# Altium project EFR32xG1x_DISC_WIDEBAND_REF_DES_A00.PrjPcb
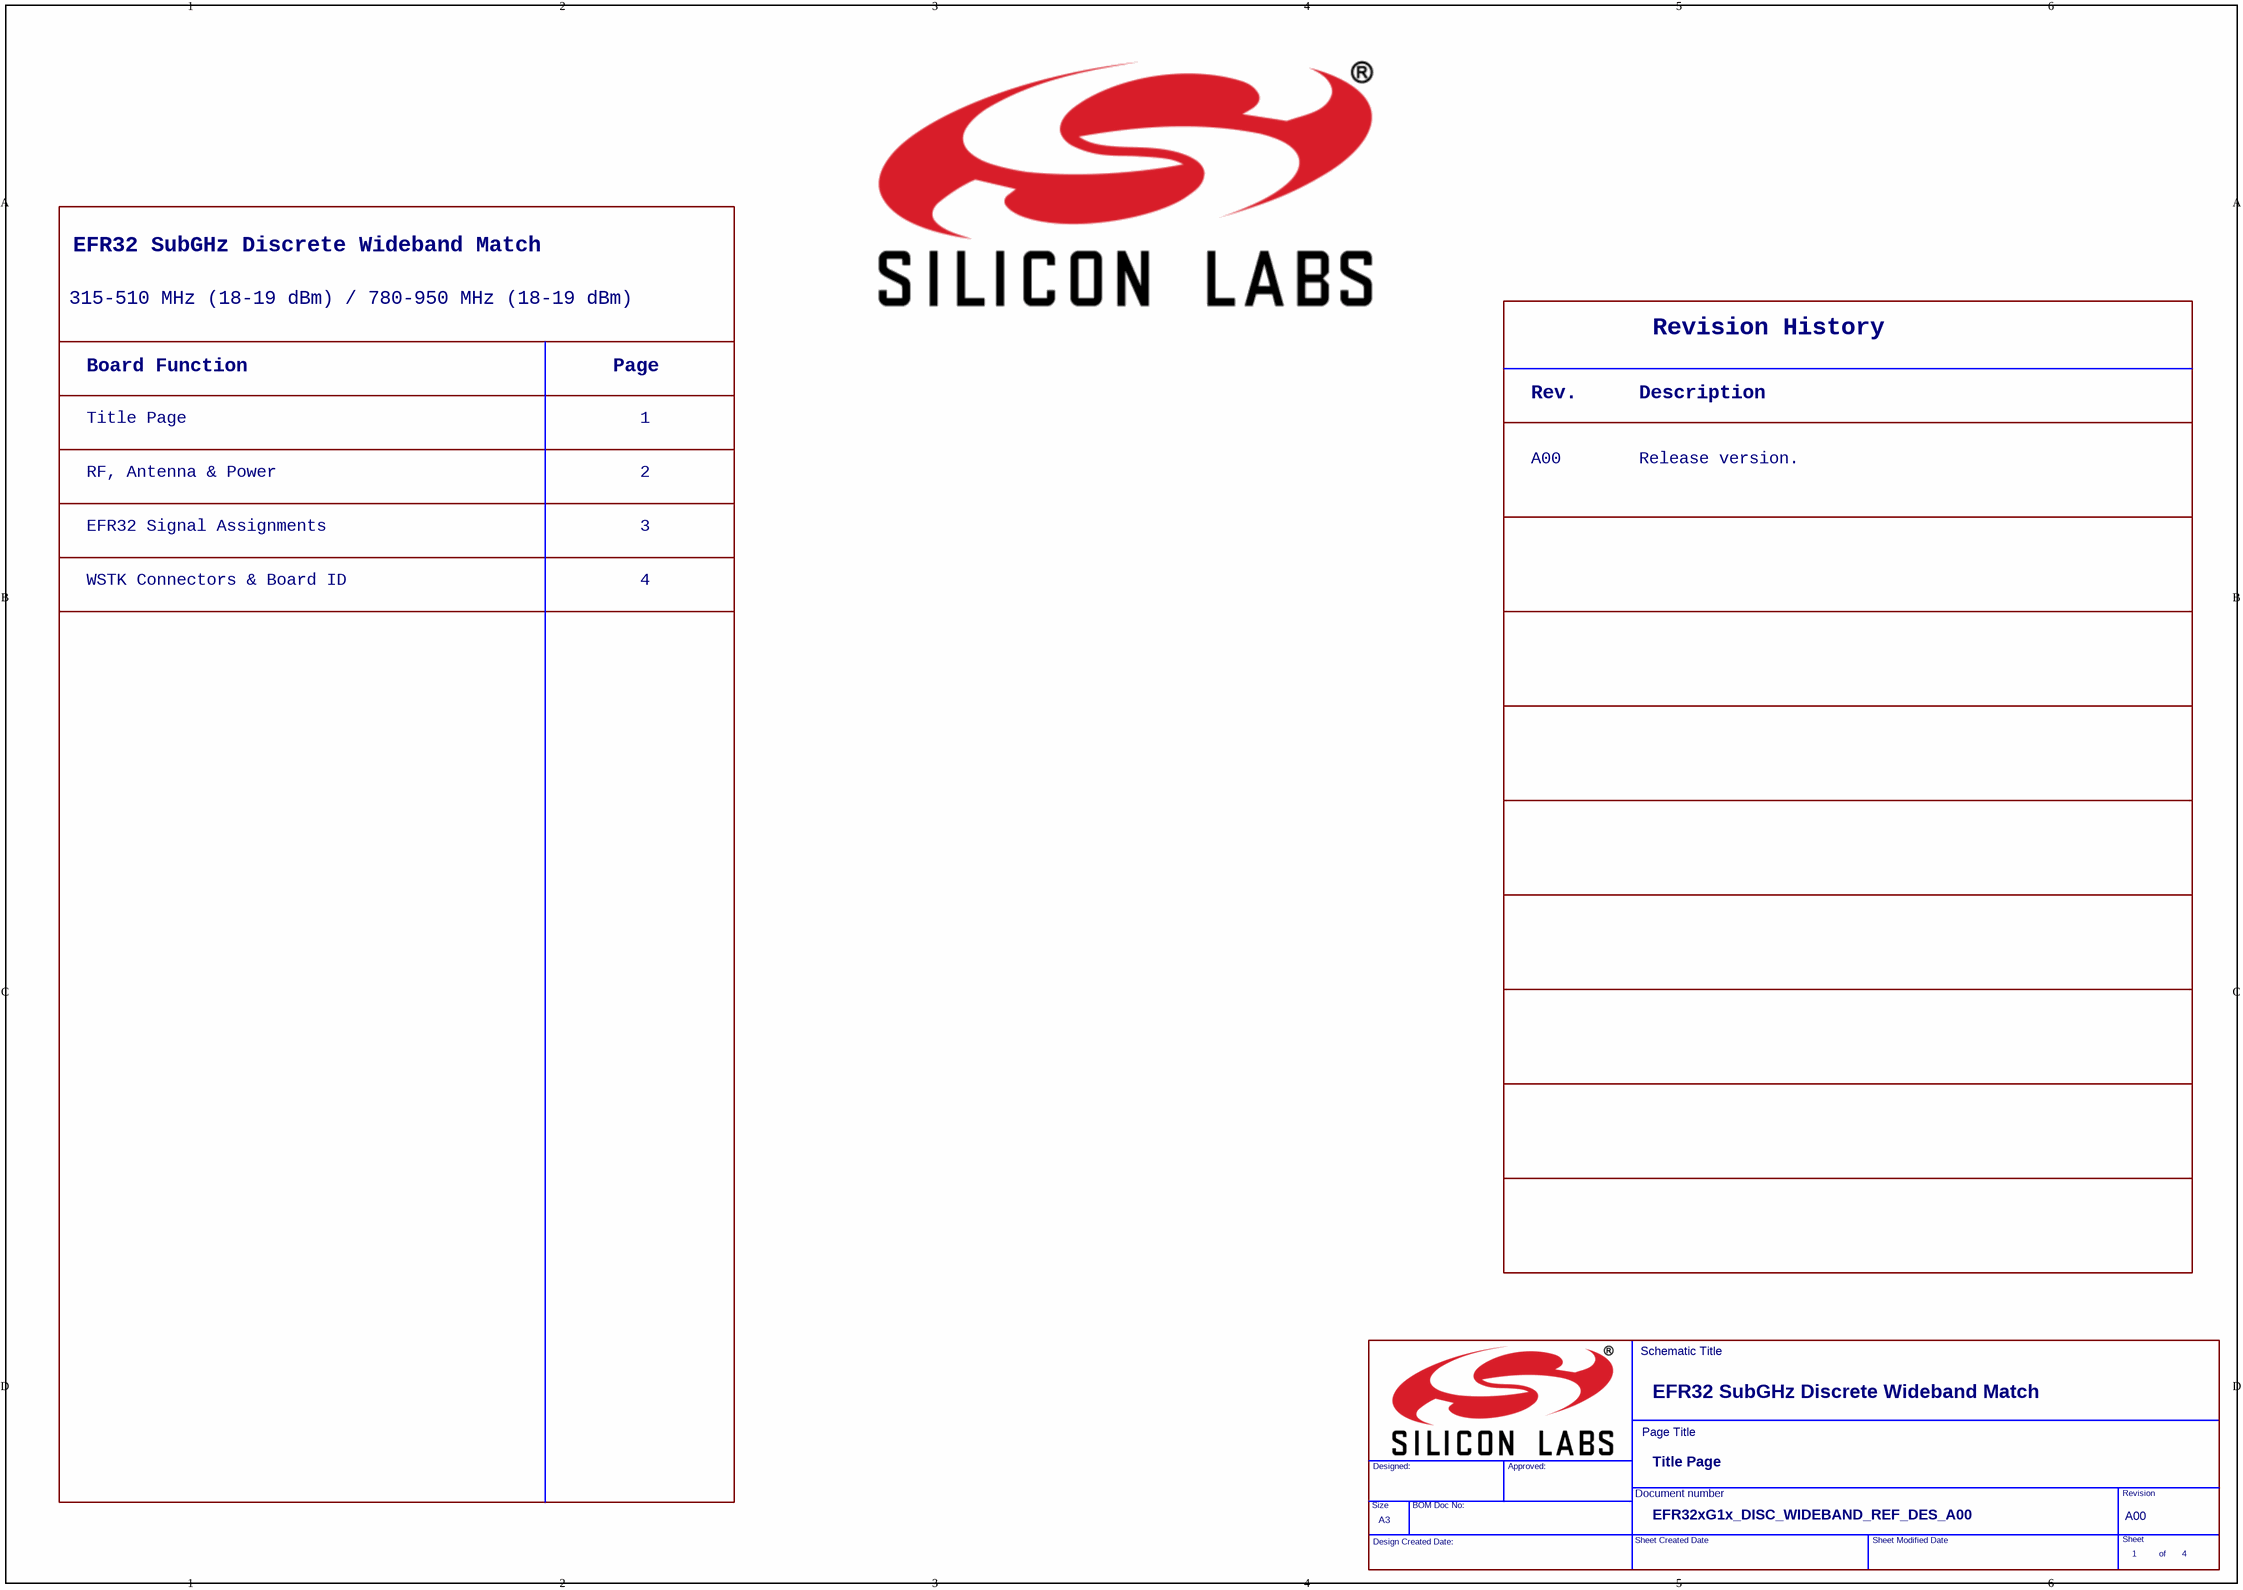
[diagram p0: EFR32xG1x_DISC_WIDEBAND_REF_DES_A00_01_Title_Page.SchDoc]
6 sheets, 205 parts. Net scope: global (net labels, ports and power ports of the same name join across sheets).
Sheets:
  EFR32xG1x_DISC_WIDEBAND_REF_DES_A00_01_Title_Page.SchDoc
  EFR32xG1x_DISC_WIDEBAND_REF_DES_A00_02_ RF,Antenna&Power_HB_HQ.SchDoc
  EFR32xG1x_DISC_WIDEBAND_REF_DES_A00_02_ RF,Antenna&Power_HB_TN.SchDoc
  EFR32xG1x_DISC_WIDEBAND_REF_DES_A00_02_ RF,Antenna&Power_LB.SchDoc
  EFR32xG1x_DISC_WIDEBAND_REF_DES_A00_03_ EFR32_Signal_Assignment.SchDoc
  EFR32xG1x_DISC_WIDEBAND_REF_DES_A00_04_ WSTK_Connectors&B.SchDoc

## Sheet EFR32xG1x_DISC_WIDEBAND_REF_DES_A00_01_Title_Page.SchDoc
size 420 x 297 mm

### Parts
(Parts that share a designator on the sheet are numbered #1, #2 ... from top to bottom, then left to right.)
*#1  Header A: EFR32 SubGHz Discrete Wideband Match  (hidden comment: Toc_Header)  (graphical)
*#2  Rev1: A00  Dscr1A: Release version.  (hidden comment: Rev_History)  (graphical)
*#3  Page Title: Title Page  Page Size: A3  RevCode: A00  Title: EFR32 SubGHz Discrete Wideband Match  Doc: EFR32xG1x_DISC_WIDEBAND_REF_DES_A00  Page Number: 1  Page Count: 4  (hidden comment: TitleBlock_EnergyMicro_A3)  (graphical)

### Notes on the sheet
- 315-510 MHz (18-19 dBm) / 780-950 MHz (18-19 dBm)
- Board Function
- Page
- Title Page
- 1
- EFR32 Signal Assignments
- RF, Antenna & Power
- 2
- 3
- WSTK Connectors & Board ID
- 4
- (in symbol Rev_History) Revision History; Rev.; Description
- (in symbol TitleBlock_EnergyMicro_A3) Schematic Title; Page Title; Designed:; Approved:; Document number; Revision; Size; BOM Doc No:; Sheet; Design Created Date:; Sheet Created Date; Sheet Modified Date; of

### Library data of the parts
*#1 = Toc_Header: Doc: BRD4150A; Page Count: 5; Page Number: 1; OrgName: Silicon Labs; RevCode: PC02
*#2 = Rev_History: Rev2: PC01; Rev3: PC02; Rev5: B00; Rev6: B01; Dscr3A: Updated sub-GHz matching network from; Dscr2A: Moved SENSOR_ENABLE.; Dscr3B: 14 dBm to 13 dBm; Dscr6A: Updated EFR32MG to Rev B0.; Dscr5A: Tuned PCB antenna and updated RF; Dscr4A: First release.; Dscr5B: matching.; Page Count: 5; Page Number: 1; OrgName: Silicon Labs; OrgAddr1: JSH; OrgAddr2: JNO; Title: EFR32MG Dual Band 2400/868 MHz Radio Board; Doc: BRD4150A; Rev4: A00; RevCode: PC02

## Sheet EFR32xG1x_DISC_WIDEBAND_REF_DES_A00_02_ RF,Antenna&Power_HB_HQ.SchDoc
size 420 x 297 mm
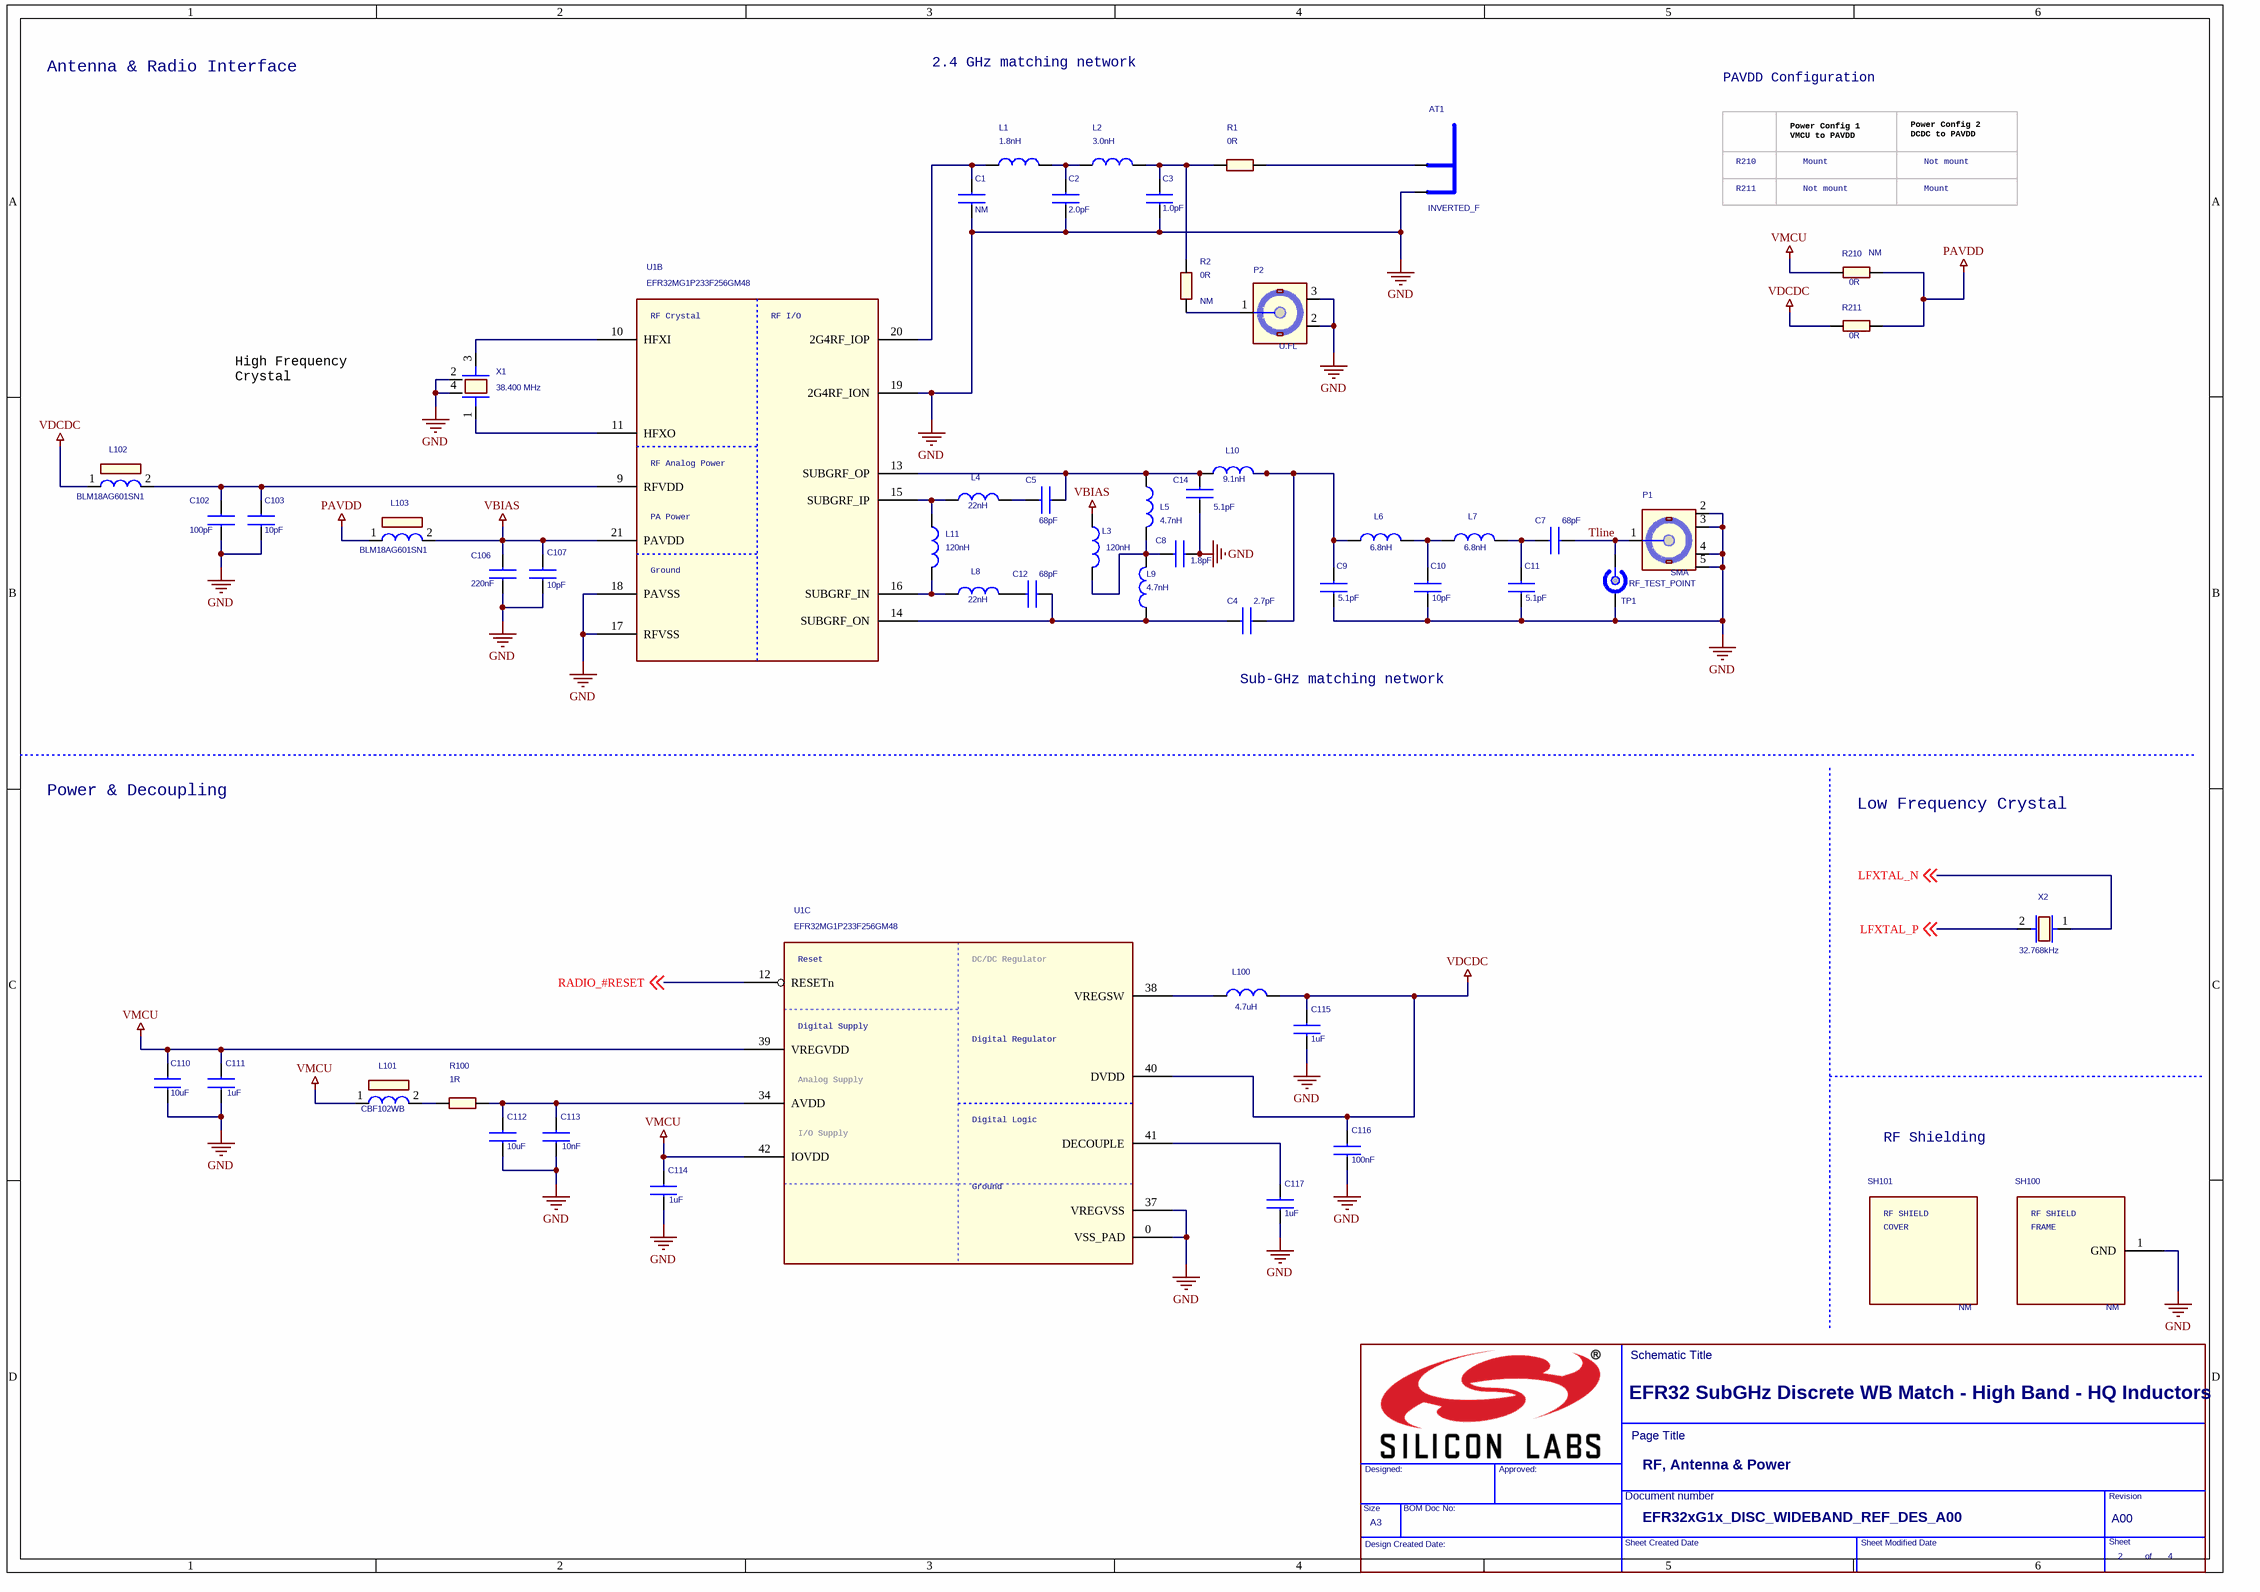
[diagram p1: EFR32xG1x_DISC_WIDEBAND_REF_DES_A00_02_ RF,Antenna&Power_HB_HQ.SchDoc]

### Parts
(Parts that share a designator on the sheet are numbered #1, #2 ... from top to bottom, then left to right.)
*#4  Page Title: RF, Antenna & Power  Page Size: A3  RevCode: A00  Title: EFR32 SubGHz Discrete WB Match - High Band - HQ Inductors  Doc: EFR32xG1x_DISC_WIDEBAND_REF_DES_A00  Page Number: 2  Page Count: 4  (hidden comment: TitleBlock_EnergyMicro_A3)  (graphical)
AT1#1  INVERTED_F  [SL_INVERTED_F]  (net tie, no BOM)
C1#1  NM  [C0201_L]
C2#1  2.0pF  [C0201_L]
C3#1  1.0pF  [C0201_L]
C4#1  2.7pF  [C0201_L]
C5#1  68pF  [C0201_L]
C7#1  68pF  [C0201_L]
C8#1  1.8pF  [C0201_L]
C9#1  5.1pF  [C0201_L]
C10#1  10pF  [C0201_L]
C11#1  5.1pF  [C0201_L]
C12#1  68pF  [C0201_L]
C14#1  5.1pF  [C0201_L]
C102#1  100pF  [C0402_L]
C103#1  10pF  [C0402_L]
C106#1  220nF  [C0402_L]
C107#1  10pF  [C0201_L]
C110#1  10uF  [C0603_L]
C111#1  1uF  [C0402_L]
C112#1  10uF  [C0603_L]
C113#1  10nF  [C0402_L]
C114#1  1uF  [C0402_L]
C115#1  1uF  [C0402_L]
C116#1  100nF  [C0402_L]
C117#1  1uF  [C0402_L]
L1#1  1.8nH  [L0201_L]
L2#1  3.0nH  [L0201_L]
L3#1  120nH  [L0201_L]
L4#1  22nH  [L0201_L]
L5#1  4.7nH  [L0201_L]
L6#1  6.8nH  [L0201_L]
L7#1  6.8nH  [L0201_L]
L8#1  22nH  [L0201_L]
L9#1  4.7nH  [L0201_L]
L10#1  9.1nH  [L0201_L]
L11#1  120nH  [L0201_L]
L100#1  4.7uH  [COIL_MUR_LQH3NP_1212]
L101#1  CBF102WB  [WURTH_CBF_0603]
L102#1  BLM18AG601SN1  [COIL_MUR_BLM18_0603]
L103#1  BLM18AG601SN1  [COIL_MUR_BLM18_0603]
P1#1  SMA  [TE_SMA_TH_1814832]
P2#1  U.FL  [HIROSE_U.FL-R-SMT-1]
R1#1  0R  [R0201_L]
R2#1  0R  Not Mounted: NM  [R0201_L]
R100#1  1R  [R0402_L]
R210#1  0R  Not Mounted: NM  [R0402_L]
R211#1  0R  [R0402_L]
SH100#1  Not Mounted: NM  [LAIRD_BMI-S-203-F]  (hidden comment: RF_SHIELD_FRAME_BMI-S-203-F)
SH101#1  Not Mounted: NM  (hidden comment: RF_SHIELD_COVER_BMI-S-203-C)
TP1#1  RF_TEST_POINT  [TP_INGUN_50_OHM_CLOSED openvia]
U1#1  EFR32MG1P233F256GM48  [QFN48_M050_SQ7.0_EP_SL_L]  (parts B,C of 3)
X1#1  38.400 MHz  [X_SSS_DSX211SH_2.05X1.65-4]
X2#1  32.768kHz  [X_MCS_CM8V-T1A]

### Nets
GND: AT1#1.2(GND) C1#1.1 C2#1.1 C3#1.1 C8#1.1 C9#1.2 C10#1.2 C11#1.2 C14#1.2 C102#1.2 C103#1.2 C106#1.2 C107#1.2 C110#1.2 C111#1.2 C112#1.2 C113#1.2 C114#1.2 C115#1.2 C116#1.2 C117#1.2 P1#1.2(GND1) P1#1.3(GND2) P1#1.4(GND3) P1#1.5(GND4) P2#1.2(GND1) P2#1.3(GND4) SH100#1.1(GND) TP1#1.2(GND) U1#1.0(VSS_PAD) U1#1.17(RFVSS) U1#1.18(PAVSS) U1#1.19(2G4RF_ION) U1#1.37(VREGVSS) X1#1.2 X1#1.4
PAVDD: L103#1.1 R210#1.1 R211#1.1
VBIAS: C106#1.1 C107#1.1 L3#1.2 L103#1.2 U1#1.21(PAVDD)
VDCDC: C115#1.1 C116#1.1 L100#1.2 L102#1.1 R211#1.2 U1#1.40(DVDD)
VMCU: C110#1.1 C111#1.1 C114#1.1 L101#1.1 R210#1.2 U1#1.39(VREGVDD) U1#1.42(IOVDD)
LFXTAL_N: X2#1.1 ; off-sheet LFXTAL_N  [project net RADIO_PB15]
LFXTAL_P: X2#1.2 ; off-sheet LFXTAL_P  [project net RADIO_PB14]
RADIO_#RESET: U1#1.12(RESETn) ; off-sheet RADIO_#RESET  [project net DEBUG.RESET]
Tline: C7#1.2 P1#1.1(SIGNAL) TP1#1.1(RF)
NetAT1#1_1: AT1#1.1(ANT) R1#1.2
NetC1#1_2: C1#1.2 L1#1.1 U1#1.20(2G4RF_IOP)
NetC2#1_2: C2#1.2 L1#1.2 L2#1.1
NetC3#1_2: C3#1.2 L2#1.2 R1#1.1 R2#1.1
NetC4#1_1: C4#1.1 C12#1.2 L9#1.2 U1#1.14(SUBGRF_ON)
NetC4#1_2: C4#1.2 C9#1.1 L6#1.2 L10#1.1
NetC5#1_1: C5#1.1 L4#1.1
NetC5#1_2: C5#1.2 C14#1.1 L5#1.2 L10#1.2 U1#1.13(SUBGRF_OP)
NetC7#1_1: C7#1.1 C11#1.1 L7#1.1
NetC8#1_2: C8#1.2 L3#1.1 L5#1.1 L9#1.1
NetC10#1_1: C10#1.1 L6#1.1 L7#1.2
NetC12#1_1: C12#1.1 L8#1.1
NetC102#1_1: C102#1.1 C103#1.1 L102#1.2 U1#1.9(RFVDD)
NetC112#1_1: C112#1.1 C113#1.1 R100#1.2 U1#1.34(AVDD)
NetC117#1_1: C117#1.1 U1#1.41(DECOUPLE)
NetL4#1_2: L4#1.2 L11#1.2 U1#1.15(SUBGRF_IP)
NetL8#1_2: L8#1.2 L11#1.1 U1#1.16(SUBGRF_IN)
NetL100#1_1: L100#1.1 U1#1.38(VREGSW)
NetL101#1_2: L101#1.2 R100#1.1
NetP2#1_1: P2#1.1(SIGNAL) R2#1.2
NetU1#1_10: U1#1.10(HFXI) X1#1.3
NetU1#1_11: U1#1.11(HFXO) X1#1.1

### Notes on the sheet
- Antenna & Radio Interface
- 2.4 GHz matching network
- PAVDD Configuration
- R210
- R211
- Power Config 1
  VMCU to PAVDD
- Not mount
- Mount
- Power Config 2
  DCDC to PAVDD
- High Frequency
  Crystal
- Sub-GHz matching network
- Power & Decoupling
- Low Frequency Crystal
- (near SH101#1) RF Shielding
- (in symbol EFR32-DUALBAND-QFN48, part B) RF Crystal; RF I/O; RF Analog Power; PA Power; Ground
- (in symbol EFR32-DUALBAND-QFN48, part C) Reset; DC/DC Regulator; Digital Supply; Digital Regulator; Analog Supply; Digital Logic; I/O Supply; Ground
- (in symbol RF_SHIELD_COVER_BMI-S-203-C) RF SHIELD; COVER
- (in symbol RF_SHIELD_FRAME_BMI-S-203-F) RF SHIELD; FRAME
- (in symbol TitleBlock_EnergyMicro_A3) Schematic Title; Page Title; Designed:; Approved:; Document number; Revision; Size; BOM Doc No:; Sheet; Design Created Date:; Sheet Created Date; Sheet Modified Date; of

### Library data of the parts
AT1#1 = ANT_INVERTED_F
C1#1 = C0402: Manufacturer Part Number: GRM0335 Series; Manufacturer: Murata; Tolerance: ±0.05P; Technology: C0G
C2#1 C3#1 C4#1 C8#1 C14#1 = C0402: Manufacturer Part Number: GRM0335 Series; Manufacturer: Murata; Tolerance: ±0.05pF; Technology: C0G
C5#1 C7#1 C12#1 = C0402: Manufacturer Part Number: GRM0335 Series; Manufacturer: Murata; Tolerance: ±5%; Technology: C0G
C9#1 C11#1 = C0402: Manufacturer Part Number: GRM0335 Series; Manufacturer: Murata; Tolerance: ±0.1pF; Technology: C0G
C10#1 = C0402: Manufacturer Part Number: GRM0335 Series; Manufacturer: Murata; Tolerance: ±0.25pF; Technology: C0G
C102#1 C103#1 C107#1 = C0402: Tolerance: 5%; Rating: 50V; Technology: C0G
C106#1 C113#1 C116#1 = C0402: Tolerance: 10%; Rating: 16V; Technology: X7R
C110#1 C112#1 = C0603: Tolerance: 20%; Rating: 6.3V; Technology: X5R
C111#1 C114#1 C115#1 C117#1 = C0402: Tolerance: 10%; Rating: 25V; Technology: X5R
L1#1 L2#1 = L0402: Manufacturer Part Number: LQP03TN Series; Manufacturer: Murata; Tolerance: ±0.05nH
L3#1 L11#1 = L0402: Manufacturer Part Number: LQP03HQ Series; Manufacturer: Murata; Tolerance: ±5%
L4#1 L5#1 L8#1 L9#1 L10#1 = L0402: Manufacturer Part Number: LQP03HQ Series; Manufacturer: Murata; Tolerance: ±0.1nH
L6#1 L7#1 = L0402: Manufacturer Part Number: LQP03HQ Series; Manufacturer: Murata; Tolerance: ±2%
L100#1 = LQH3NP: Mfg #: LQH3NPN4R7MM0L; Mfg: Murata
L101#1 = CBF102WB: Mfg #: 74279266; Mfg: Würth Electronics; Price_1K: 0.031
L102#1 L103#1 = BLM18AG: Mfg #: BLM18AG601SN1D; Mfg: Murata; Price_1K: 0.027
P1#1 = SMA_TH: Mfg: TE Connectivity; Mfg #: 5-1814832-1; Price_1K: 1.46
P2#1 = HIROSE_U.FL: Mfg #: U.FL-R-SMT-1; Mfg: Hirose; Price_1K: 0.70
R1#1 R2#1 R100#1 R210#1 R211#1 = R0402: Price_1K: 0.005
SH100#1 = RF_SHIELD_FRAME_BMI-S-203-F: Mfg: Laird Technologies; Footprint: Laird_BMI-S-203-F; Mfg #: BMI-S-203-F; Price_1k: 1.148
SH101#1 = RF_SHIELD_COVER_BMI-S-203-C: Mfg: Laird Technologies; Price_1k: 0.814; Mfg #: BMI-S-203-C
TP1#1 = TP_RF
U1#1 = EFR32-DUALBAND-QFN48: Manufacturer Part Number: EFR32MG1P233F256GM48-B0; Manufacturer: Silicon Labs
X1#1 = DSX211SH: Manufacturer Part Number: DSX211SH 1ZZNAE38400AB0A; Manufacturer: KDS; Tolerance: ±20ppm; Price_1K: 0.512
X2#1 = CM8V-T1A: Manufacturer: Micro Crystal AG; Tolerance: ±20ppm; Price_1K: 0.3

## Sheet EFR32xG1x_DISC_WIDEBAND_REF_DES_A00_02_ RF,Antenna&Power_HB_TN.SchDoc
size 420 x 297 mm
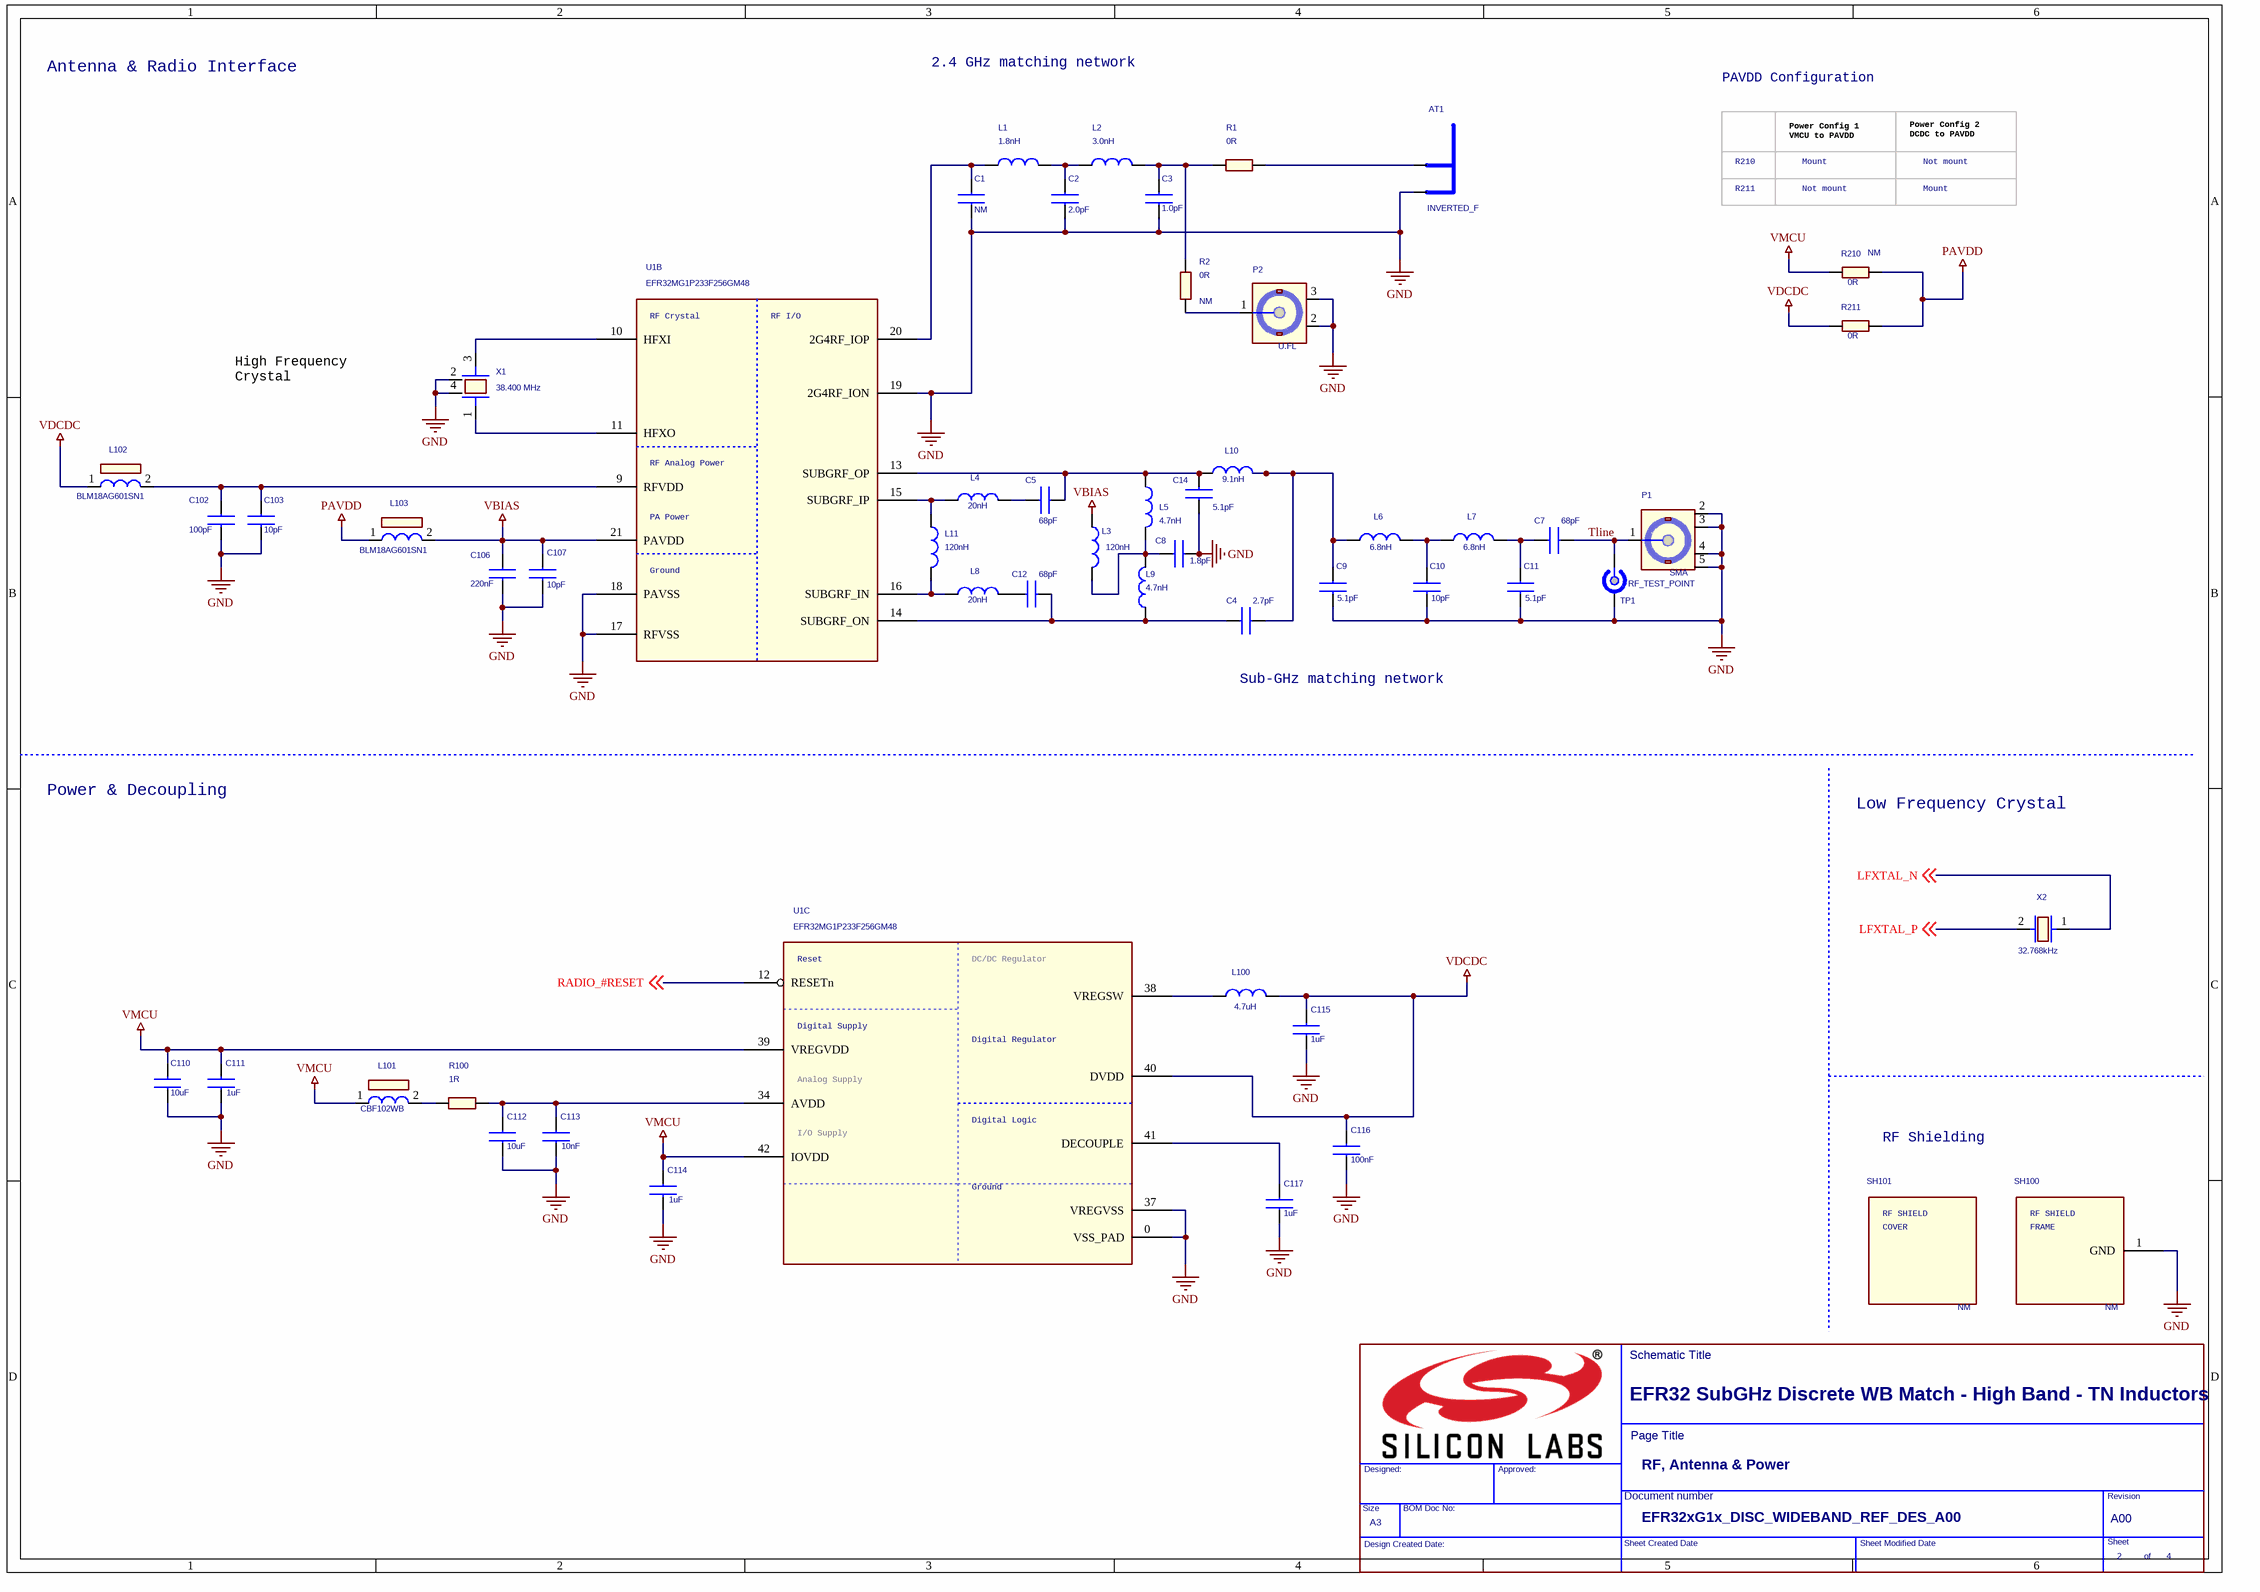
[diagram p2: EFR32xG1x_DISC_WIDEBAND_REF_DES_A00_02_ RF,Antenna&Power_HB_TN.SchDoc]

### Parts
(Parts that share a designator on the sheet are numbered #1, #2 ... from top to bottom, then left to right.)
*#5  Page Title: RF, Antenna & Power  Page Size: A3  RevCode: A00  Title: EFR32 SubGHz Discrete WB Match - High Band - TN Inductors  Doc: EFR32xG1x_DISC_WIDEBAND_REF_DES_A00  Page Number: 2  Page Count: 4  (hidden comment: TitleBlock_EnergyMicro_A3)  (graphical)
AT1#2  INVERTED_F  [SL_INVERTED_F]  (net tie, no BOM)
C1#2  NM  [C0201_L]
C2#2  2.0pF  [C0201_L]
C3#2  1.0pF  [C0201_L]
C4#2  2.7pF  [C0201_L]
C5#2  68pF  [C0201_L]
C7#2  68pF  [C0201_L]
C8#2  1.8pF  [C0201_L]
C9#2  5.1pF  [C0201_L]
C10#2  10pF  [C0201_L]
C11#2  5.1pF  [C0201_L]
C12#2  68pF  [C0201_L]
C14#2  5.1pF  [C0201_L]
C102#2  100pF  [C0402_L]
C103#2  10pF  [C0402_L]
C106#2  220nF  [C0402_L]
C107#2  10pF  [C0201_L]
C110#2  10uF  [C0603_L]
C111#2  1uF  [C0402_L]
C112#2  10uF  [C0603_L]
C113#2  10nF  [C0402_L]
C114#2  1uF  [C0402_L]
C115#2  1uF  [C0402_L]
C116#2  100nF  [C0402_L]
C117#2  1uF  [C0402_L]
L1#2  1.8nH  [L0201_L]
L2#2  3.0nH  [L0201_L]
L3#2  120nH  [L0201_L]
L4#2  20nH  [L0201_L]
L5#2  4.7nH  [L0201_L]
L6#2  6.8nH  [L0201_L]
L7#2  6.8nH  [L0201_L]
L8#2  20nH  [L0201_L]
L9#2  4.7nH  [L0201_L]
L10#2  9.1nH  [L0201_L]
L11#2  120nH  [L0201_L]
L100#2  4.7uH  [COIL_MUR_LQH3NP_1212]
L101#2  CBF102WB  [WURTH_CBF_0603]
L102#2  BLM18AG601SN1  [COIL_MUR_BLM18_0603]
L103#2  BLM18AG601SN1  [COIL_MUR_BLM18_0603]
P1#2  SMA  [TE_SMA_TH_1814832]
P2#2  U.FL  [HIROSE_U.FL-R-SMT-1]
R1#2  0R  [R0201_L]
R2#2  0R  Not Mounted: NM  [R0201_L]
R100#2  1R  [R0402_L]
R210#2  0R  Not Mounted: NM  [R0402_L]
R211#2  0R  [R0402_L]
SH100#2  Not Mounted: NM  [LAIRD_BMI-S-203-F]  (hidden comment: RF_SHIELD_FRAME_BMI-S-203-F)
SH101#2  Not Mounted: NM  (hidden comment: RF_SHIELD_COVER_BMI-S-203-C)
TP1#2  RF_TEST_POINT  [TP_INGUN_50_OHM_CLOSED openvia]
U1#2  EFR32MG1P233F256GM48  [QFN48_M050_SQ7.0_EP_SL_L]  (parts B,C of 3)
X1#2  38.400 MHz  [X_SSS_DSX211SH_2.05X1.65-4]
X2#2  32.768kHz  [X_MCS_CM8V-T1A]

### Nets
GND: AT1#2.2(GND) C1#2.1 C2#2.1 C3#2.1 C8#2.1 C9#2.2 C10#2.2 C11#2.2 C14#2.2 C102#2.2 C103#2.2 C106#2.2 C107#2.2 C110#2.2 C111#2.2 C112#2.2 C113#2.2 C114#2.2 C115#2.2 C116#2.2 C117#2.2 P1#2.2(GND1) P1#2.3(GND2) P1#2.4(GND3) P1#2.5(GND4) P2#2.2(GND1) P2#2.3(GND4) SH100#2.1(GND) TP1#2.2(GND) U1#2.0(VSS_PAD) U1#2.17(RFVSS) U1#2.18(PAVSS) U1#2.19(2G4RF_ION) U1#2.37(VREGVSS) X1#2.2 X1#2.4
PAVDD: L103#2.1 R210#2.1 R211#2.1
VBIAS: C106#2.1 C107#2.1 L3#2.2 L103#2.2 U1#2.21(PAVDD)
VDCDC: C115#2.1 C116#2.1 L100#2.2 L102#2.1 R211#2.2 U1#2.40(DVDD)
VMCU: C110#2.1 C111#2.1 C114#2.1 L101#2.1 R210#2.2 U1#2.39(VREGVDD) U1#2.42(IOVDD)
LFXTAL_N: X2#2.1 ; off-sheet LFXTAL_N  [project net RADIO_PB15]
LFXTAL_P: X2#2.2 ; off-sheet LFXTAL_P  [project net RADIO_PB14]
RADIO_#RESET: U1#2.12(RESETn) ; off-sheet RADIO_#RESET  [project net DEBUG.RESET]
Tline: C7#2.2 P1#2.1(SIGNAL) TP1#2.1(RF)
NetAT1#2_1: AT1#2.1(ANT) R1#2.2
NetC1#2_2: C1#2.2 L1#2.1 U1#2.20(2G4RF_IOP)
NetC2#2_2: C2#2.2 L1#2.2 L2#2.1
NetC3#2_2: C3#2.2 L2#2.2 R1#2.1 R2#2.1
NetC4#2_1: C4#2.1 C12#2.2 L9#2.2 U1#2.14(SUBGRF_ON)
NetC4#2_2: C4#2.2 C9#2.1 L6#2.2 L10#2.1
NetC5#2_1: C5#2.1 L4#2.1
NetC5#2_2: C5#2.2 C14#2.1 L5#2.2 L10#2.2 U1#2.13(SUBGRF_OP)
NetC7#2_1: C7#2.1 C11#2.1 L7#2.1
NetC8#2_2: C8#2.2 L3#2.1 L5#2.1 L9#2.1
NetC10#2_1: C10#2.1 L6#2.1 L7#2.2
NetC12#2_1: C12#2.1 L8#2.1
NetC102#2_1: C102#2.1 C103#2.1 L102#2.2 U1#2.9(RFVDD)
NetC112#2_1: C112#2.1 C113#2.1 R100#2.2 U1#2.34(AVDD)
NetC117#2_1: C117#2.1 U1#2.41(DECOUPLE)
NetL4#2_2: L4#2.2 L11#2.2 U1#2.15(SUBGRF_IP)
NetL8#2_2: L8#2.2 L11#2.1 U1#2.16(SUBGRF_IN)
NetL100#2_1: L100#2.1 U1#2.38(VREGSW)
NetL101#2_2: L101#2.2 R100#2.1
NetP2#2_1: P2#2.1(SIGNAL) R2#2.2
NetU1#2_10: U1#2.10(HFXI) X1#2.3
NetU1#2_11: U1#2.11(HFXO) X1#2.1

### Notes on the sheet
- Antenna & Radio Interface
- 2.4 GHz matching network
- PAVDD Configuration
- R210
- R211
- Power Config 1
  VMCU to PAVDD
- Not mount
- Mount
- Power Config 2
  DCDC to PAVDD
- High Frequency
  Crystal
- Sub-GHz matching network
- Power & Decoupling
- Low Frequency Crystal
- (near SH101#2) RF Shielding
- (in symbol EFR32-DUALBAND-QFN48, part B) RF Crystal; RF I/O; RF Analog Power; PA Power; Ground
- (in symbol EFR32-DUALBAND-QFN48, part C) Reset; DC/DC Regulator; Digital Supply; Digital Regulator; Analog Supply; Digital Logic; I/O Supply; Ground
- (in symbol RF_SHIELD_COVER_BMI-S-203-C) RF SHIELD; COVER
- (in symbol RF_SHIELD_FRAME_BMI-S-203-F) RF SHIELD; FRAME
- (in symbol TitleBlock_EnergyMicro_A3) Schematic Title; Page Title; Designed:; Approved:; Document number; Revision; Size; BOM Doc No:; Sheet; Design Created Date:; Sheet Created Date; Sheet Modified Date; of

### Library data of the parts
AT1#2 = ANT_INVERTED_F
C1#2 = C0402: as C1#1 on sheet EFR32xG1x_DISC_WIDEBAND_REF_DES_A00_02_ RF,Antenna&Power_HB_HQ; Technology: C0G
C2#2 C3#2 C4#2 C8#2 C14#2 = C0402: as C2#1 on sheet EFR32xG1x_DISC_WIDEBAND_REF_DES_A00_02_ RF,Antenna&Power_HB_HQ; Technology: C0G
C5#2 C7#2 C12#2 = C0402: as C5#1 on sheet EFR32xG1x_DISC_WIDEBAND_REF_DES_A00_02_ RF,Antenna&Power_HB_HQ; Technology: C0G
C9#2 C11#2 = C0402: as C9#1 on sheet EFR32xG1x_DISC_WIDEBAND_REF_DES_A00_02_ RF,Antenna&Power_HB_HQ; Technology: C0G
C10#2 = C0402: as C10#1 on sheet EFR32xG1x_DISC_WIDEBAND_REF_DES_A00_02_ RF,Antenna&Power_HB_HQ; Technology: C0G
C102#2 C103#2 C107#2 = C0402: Tolerance: 5%; Rating: 50V; Technology: C0G
C106#2 C113#2 C116#2 = C0402: Tolerance: 10%; Rating: 16V; Technology: X7R
C110#2 C112#2 = C0603: Tolerance: 20%; Rating: 6.3V; Technology: X5R
C111#2 C114#2 C115#2 C117#2 = C0402: Tolerance: 10%; Rating: 25V; Technology: X5R
L1#2 L2#2 = L0402: as L1#1 on sheet EFR32xG1x_DISC_WIDEBAND_REF_DES_A00_02_ RF,Antenna&Power_HB_HQ
L3#2 L11#2 = L0402: Manufacturer Part Number: LQP03TN Series; Manufacturer: Murata; Tolerance: ±5%
L4#2 L5#2 L8#2 L9#2 L10#2 = L0402: Manufacturer Part Number: LQP03TN Series; Manufacturer: Murata; Tolerance: ±0.1nH
L6#2 L7#2 = L0402: Manufacturer Part Number: LQP03TN Series; Manufacturer: Murata; Tolerance: ±2%
L100#2 = LQH3NP: Mfg #: LQH3NPN4R7MM0L; Mfg: Murata
L101#2 = CBF102WB: Mfg #: 74279266; Mfg: Würth Electronics; Price_1K: 0.031
L102#2 L103#2 = BLM18AG: Mfg #: BLM18AG601SN1D; Mfg: Murata; Price_1K: 0.027
P1#2 = SMA_TH: Mfg: TE Connectivity; Mfg #: 5-1814832-1; Price_1K: 1.46
P2#2 = HIROSE_U.FL: Mfg #: U.FL-R-SMT-1; Mfg: Hirose; Price_1K: 0.70
R1#2 R2#2 R100#2 R210#2 R211#2 = R0402: Price_1K: 0.005
SH100#2 = RF_SHIELD_FRAME_BMI-S-203-F: Mfg: Laird Technologies; Footprint: Laird_BMI-S-203-F; Mfg #: BMI-S-203-F; Price_1k: 1.148
SH101#2 = RF_SHIELD_COVER_BMI-S-203-C: Mfg: Laird Technologies; Price_1k: 0.814; Mfg #: BMI-S-203-C
TP1#2 = TP_RF
U1#2 = EFR32-DUALBAND-QFN48: as U1#1 on sheet EFR32xG1x_DISC_WIDEBAND_REF_DES_A00_02_ RF,Antenna&Power_HB_HQ
X1#2 = DSX211SH: as X1#1 on sheet EFR32xG1x_DISC_WIDEBAND_REF_DES_A00_02_ RF,Antenna&Power_HB_HQ; Price_1K: 0.512
X2#2 = CM8V-T1A: as X2#1 on sheet EFR32xG1x_DISC_WIDEBAND_REF_DES_A00_02_ RF,Antenna&Power_HB_HQ; Price_1K: 0.3

## Sheet EFR32xG1x_DISC_WIDEBAND_REF_DES_A00_02_ RF,Antenna&Power_LB.SchDoc
size 420 x 297 mm
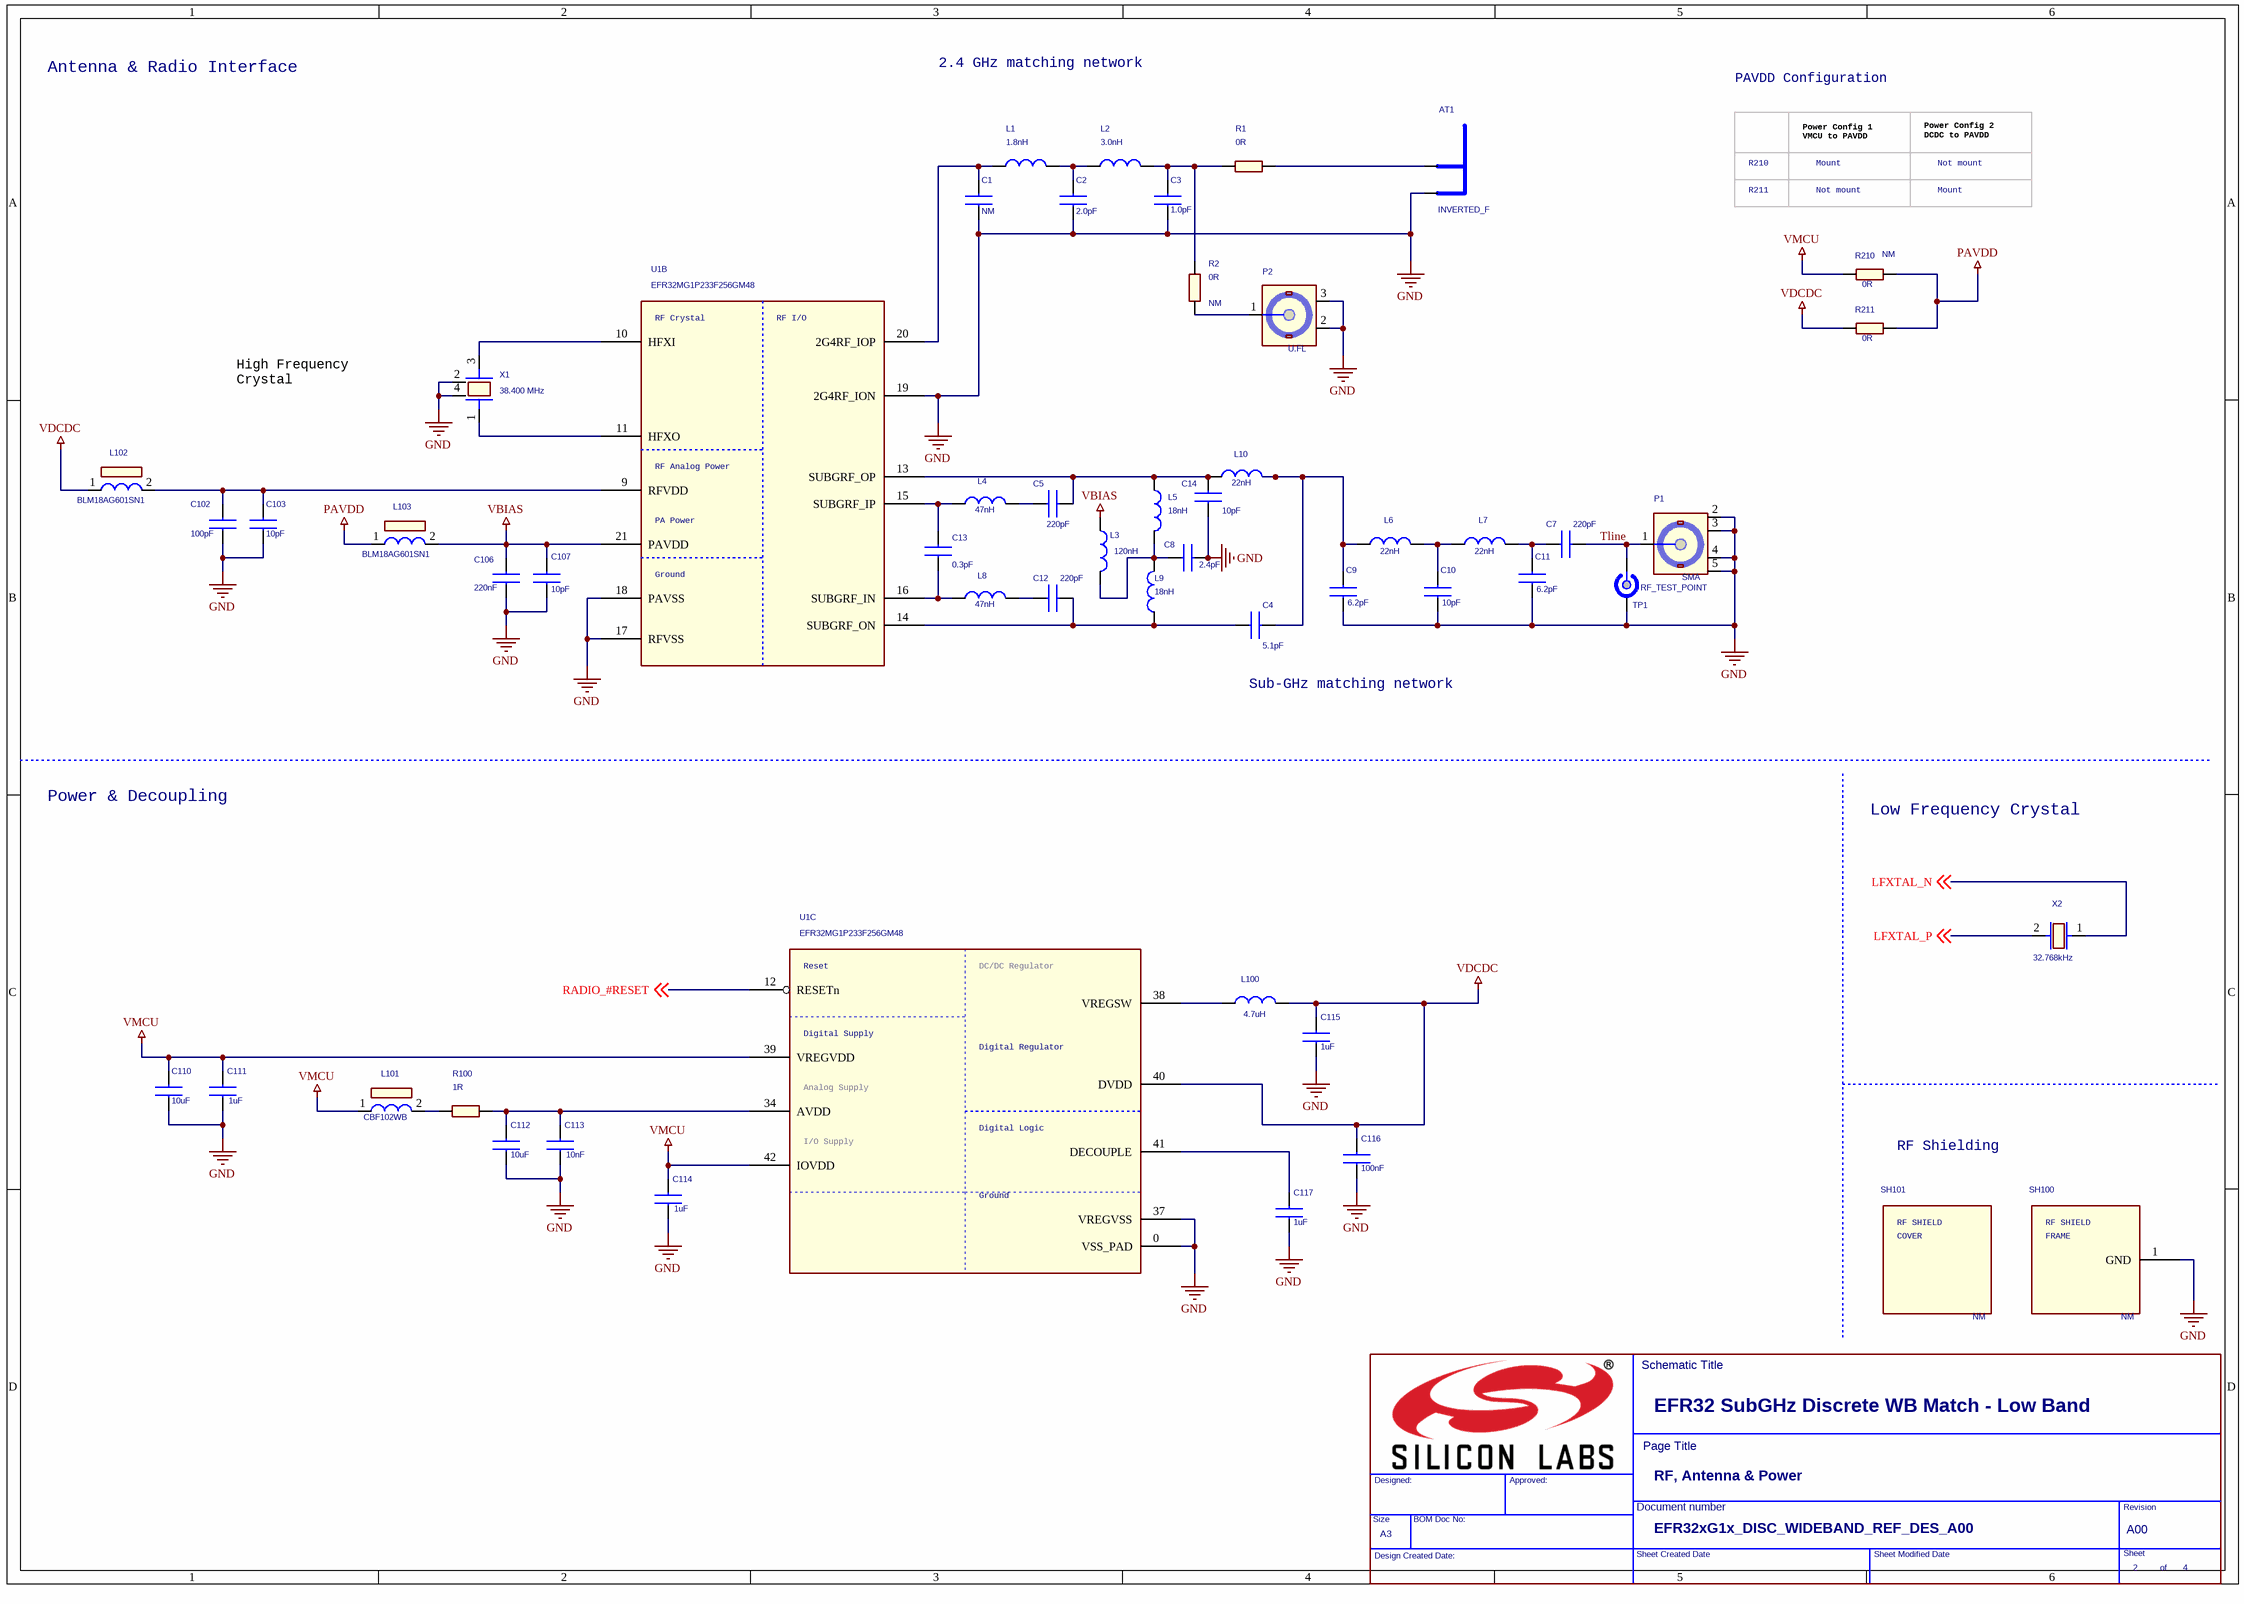
[diagram p3: EFR32xG1x_DISC_WIDEBAND_REF_DES_A00_02_ RF,Antenna&Power_LB.SchDoc]

### Parts
(Parts that share a designator on the sheet are numbered #1, #2 ... from top to bottom, then left to right.)
*#6  Page Title: RF, Antenna & Power  Page Size: A3  RevCode: A00  Title: EFR32 SubGHz Discrete WB Match - Low Band  Doc: EFR32xG1x_DISC_WIDEBAND_REF_DES_A00  Page Number: 2  Page Count: 4  (hidden comment: TitleBlock_EnergyMicro_A3)  (graphical)
AT1#3  INVERTED_F  [SL_INVERTED_F]  (net tie, no BOM)
C1#3  NM  [C0201_L]
C2#3  2.0pF  [C0201_L]
C3#3  1.0pF  [C0201_L]
C4#3  5.1pF  [C0201_L]
C5#3  220pF  [C0201_L]
C7#3  220pF  [C0201_L]
C8#3  2.4pF  [C0201_L]
C9#3  6.2pF  [C0201_L]
C10#3  10pF  [C0201_L]
C11#3  6.2pF  [C0201_L]
C12#3  220pF  [C0201_L]
C13  0.3pF  [C0201_L]
C14#3  10pF  [C0201_L]
C102#3  100pF  [C0402_L]
C103#3  10pF  [C0402_L]
C106#3  220nF  [C0402_L]
C107#3  10pF  [C0201_L]
C110#3  10uF  [C0603_L]
C111#3  1uF  [C0402_L]
C112#3  10uF  [C0603_L]
C113#3  10nF  [C0402_L]
C114#3  1uF  [C0402_L]
C115#3  1uF  [C0402_L]
C116#3  100nF  [C0402_L]
C117#3  1uF  [C0402_L]
L1#3  1.8nH  [L0201_L]
L2#3  3.0nH  [L0201_L]
L3#3  120nH  [L0201_L]
L4#3  47nH  [L0201_L]
L5#3  18nH  [L0201_L]
L6#3  22nH  [L0201_L]
L7#3  22nH  [L0201_L]
L8#3  47nH  [L0201_L]
L9#3  18nH  [L0201_L]
L10#3  22nH  [L0201_L]
L100#3  4.7uH  [COIL_MUR_LQH3NP_1212]
L101#3  CBF102WB  [WURTH_CBF_0603]
L102#3  BLM18AG601SN1  [COIL_MUR_BLM18_0603]
L103#3  BLM18AG601SN1  [COIL_MUR_BLM18_0603]
P1#3  SMA  [TE_SMA_TH_1814832]
P2#3  U.FL  [HIROSE_U.FL-R-SMT-1]
R1#3  0R  [R0201_L]
R2#3  0R  Not Mounted: NM  [R0201_L]
R100#3  1R  [R0402_L]
R210#3  0R  Not Mounted: NM  [R0402_L]
R211#3  0R  [R0402_L]
SH100#3  Not Mounted: NM  [LAIRD_BMI-S-203-F]  (hidden comment: RF_SHIELD_FRAME_BMI-S-203-F)
SH101#3  Not Mounted: NM  (hidden comment: RF_SHIELD_COVER_BMI-S-203-C)
TP1#3  RF_TEST_POINT  [TP_INGUN_50_OHM_CLOSED openvia]
U1#3  EFR32MG1P233F256GM48  [QFN48_M050_SQ7.0_EP_SL_L]  (parts B,C of 3)
X1#3  38.400 MHz  [X_SSS_DSX211SH_2.05X1.65-4]
X2#3  32.768kHz  [X_MCS_CM8V-T1A]

### Nets
GND: AT1#3.2(GND) C1#3.1 C2#3.1 C3#3.1 C8#3.1 C9#3.2 C10#3.2 C11#3.2 C14#3.2 C102#3.2 C103#3.2 C106#3.2 C107#3.2 C110#3.2 C111#3.2 C112#3.2 C113#3.2 C114#3.2 C115#3.2 C116#3.2 C117#3.2 P1#3.2(GND1) P1#3.3(GND2) P1#3.4(GND3) P1#3.5(GND4) P2#3.2(GND1) P2#3.3(GND4) SH100#3.1(GND) TP1#3.2(GND) U1#3.0(VSS_PAD) U1#3.17(RFVSS) U1#3.18(PAVSS) U1#3.19(2G4RF_ION) U1#3.37(VREGVSS) X1#3.2 X1#3.4
PAVDD: L103#3.1 R210#3.1 R211#3.1
VBIAS: C106#3.1 C107#3.1 L3#3.2 L103#3.2 U1#3.21(PAVDD)
VDCDC: C115#3.1 C116#3.1 L100#3.2 L102#3.1 R211#3.2 U1#3.40(DVDD)
VMCU: C110#3.1 C111#3.1 C114#3.1 L101#3.1 R210#3.2 U1#3.39(VREGVDD) U1#3.42(IOVDD)
LFXTAL_N: X2#3.1 ; off-sheet LFXTAL_N  [project net RADIO_PB15]
LFXTAL_P: X2#3.2 ; off-sheet LFXTAL_P  [project net RADIO_PB14]
RADIO_#RESET: U1#3.12(RESETn) ; off-sheet RADIO_#RESET  [project net DEBUG.RESET]
Tline: C7#3.2 P1#3.1(SIGNAL) TP1#3.1(RF)
NetAT1#3_1: AT1#3.1(ANT) R1#3.2
NetC1#3_2: C1#3.2 L1#3.1 U1#3.20(2G4RF_IOP)
NetC2#3_2: C2#3.2 L1#3.2 L2#3.1
NetC3#3_2: C3#3.2 L2#3.2 R1#3.1 R2#3.1
NetC4#3_1: C4#3.1 C12#3.2 L9#3.2 U1#3.14(SUBGRF_ON)
NetC4#3_2: C4#3.2 C9#3.1 L6#3.2 L10#3.1
NetC5#3_1: C5#3.1 L4#3.1
NetC5#3_2: C5#3.2 C14#3.1 L5#3.2 L10#3.2 U1#3.13(SUBGRF_OP)
NetC7#3_1: C7#3.1 C11#3.1 L7#3.1
NetC8#3_2: C8#3.2 L3#3.1 L5#3.1 L9#3.1
NetC10#3_1: C10#3.1 L6#3.1 L7#3.2
NetC12#3_1: C12#3.1 L8#3.1
NetC13_1: C13.1 L4#3.2 U1#3.15(SUBGRF_IP)
NetC13_2: C13.2 L8#3.2 U1#3.16(SUBGRF_IN)
NetC102#3_1: C102#3.1 C103#3.1 L102#3.2 U1#3.9(RFVDD)
NetC112#3_1: C112#3.1 C113#3.1 R100#3.2 U1#3.34(AVDD)
NetC117#3_1: C117#3.1 U1#3.41(DECOUPLE)
NetL100#3_1: L100#3.1 U1#3.38(VREGSW)
NetL101#3_2: L101#3.2 R100#3.1
NetP2#3_1: P2#3.1(SIGNAL) R2#3.2
NetU1#3_10: U1#3.10(HFXI) X1#3.3
NetU1#3_11: U1#3.11(HFXO) X1#3.1

### Notes on the sheet
- Antenna & Radio Interface
- 2.4 GHz matching network
- PAVDD Configuration
- R210
- R211
- Power Config 1
  VMCU to PAVDD
- Not mount
- Mount
- Power Config 2
  DCDC to PAVDD
- High Frequency
  Crystal
- Sub-GHz matching network
- Power & Decoupling
- Low Frequency Crystal
- (near SH101#3) RF Shielding
- (in symbol EFR32-DUALBAND-QFN48, part B) RF Crystal; RF I/O; RF Analog Power; PA Power; Ground
- (in symbol EFR32-DUALBAND-QFN48, part C) Reset; DC/DC Regulator; Digital Supply; Digital Regulator; Analog Supply; Digital Logic; I/O Supply; Ground
- (in symbol RF_SHIELD_COVER_BMI-S-203-C) RF SHIELD; COVER
- (in symbol RF_SHIELD_FRAME_BMI-S-203-F) RF SHIELD; FRAME
- (in symbol TitleBlock_EnergyMicro_A3) Schematic Title; Page Title; Designed:; Approved:; Document number; Revision; Size; BOM Doc No:; Sheet; Design Created Date:; Sheet Created Date; Sheet Modified Date; of

### Library data of the parts
AT1#3 = ANT_INVERTED_F
C1#3 C2#3 C3#3 C4#3 C8#3 C13 = C0402: as C2#1 on sheet EFR32xG1x_DISC_WIDEBAND_REF_DES_A00_02_ RF,Antenna&Power_HB_HQ; Technology: C0G
C5#3 C7#3 C10#3 C11#3 C12#3 C14#3 = C0402: as C10#1 on sheet EFR32xG1x_DISC_WIDEBAND_REF_DES_A00_02_ RF,Antenna&Power_HB_HQ; Technology: C0G
C9#3 = C0402: as C9#1 on sheet EFR32xG1x_DISC_WIDEBAND_REF_DES_A00_02_ RF,Antenna&Power_HB_HQ; Technology: C0G
C102#3 C103#3 C107#3 = C0402: Manufacturer: any; Tolerance: 5%; Rating: 50V; Technology: C0G
C106#3 C113#3 C116#3 = C0402: Manufacturer: any; Tolerance: 10%; Rating: 16V; Technology: X7R
C110#3 C112#3 = C0603: Manufacturer: any; Tolerance: 20%; Rating: 6.3V; Technology: X5R
C111#3 C114#3 C115#3 C117#3 = C0402: Manufacturer: any; Tolerance: 10%; Rating: 25V; Technology: X5R
L1#3 L2#3 = L0402: Manufacturer Part Number: LQP03 Series; Manufacturer: Murata; Tolerance: ±0.05nH
L3#3 = L0402: Manufacturer Part Number: LQP03 Series; Manufacturer: Murata; Tolerance: ±5%
L4#3 L5#3 L8#3 L9#3 = L0402: Manufacturer Part Number: LQP03 Series; Manufacturer: Murata; Tolerance: ±0.1nH
L6#3 L7#3 L10#3 = L0402: Manufacturer Part Number: LQP03 Series; Manufacturer: Murata; Tolerance: ±2%
L100#3 = LQH3NP: Manufacturer Part Number: LQH3NPN4R7MM0L; Manufacturer: Murata; Tolerance: ±20%
L101#3 = CBF102WB: Mfg #: 74279266; Mfg: Würth Electronics; Price_1K: 0.031
L102#3 L103#3 = BLM18AG: Mfg #: BLM18AG601SN1D; Mfg: Murata; Price_1K: 0.027
P1#3 = SMA_TH: Mfg: TE Connectivity; Mfg #: 5-1814832-1; Price_1K: 1.46
P2#3 = HIROSE_U.FL: Mfg #: U.FL-R-SMT-1; Mfg: Hirose; Price_1K: 0.70
R1#3 R2#3 R100#3 R210#3 R211#3 = R0402: Price_1K: 0.005
SH100#3 = RF_SHIELD_FRAME_BMI-S-203-F: Mfg: Laird Technologies; Footprint: Laird_BMI-S-203-F; Mfg #: BMI-S-203-F; Price_1k: 1.148
SH101#3 = RF_SHIELD_COVER_BMI-S-203-C: Mfg: Laird Technologies; Price_1k: 0.814; Mfg #: BMI-S-203-C
TP1#3 = TP_RF
U1#3 = EFR32-DUALBAND-QFN48: as U1#1 on sheet EFR32xG1x_DISC_WIDEBAND_REF_DES_A00_02_ RF,Antenna&Power_HB_HQ
X1#3 = DSX211SH: as X1#1 on sheet EFR32xG1x_DISC_WIDEBAND_REF_DES_A00_02_ RF,Antenna&Power_HB_HQ; Price_1K: 0.512
X2#3 = CM8V-T1A: Manufacturer Part Number: CM8V-T1A, 32768Hz, 12.5pF, +/- 20ppm; Manufacturer: Micro Crystal AG; Tolerance: ±20ppm; Price_1K: 0.3

## Sheet EFR32xG1x_DISC_WIDEBAND_REF_DES_A00_03_ EFR32_Signal_Assignment.SchDoc
size 420 x 297 mm
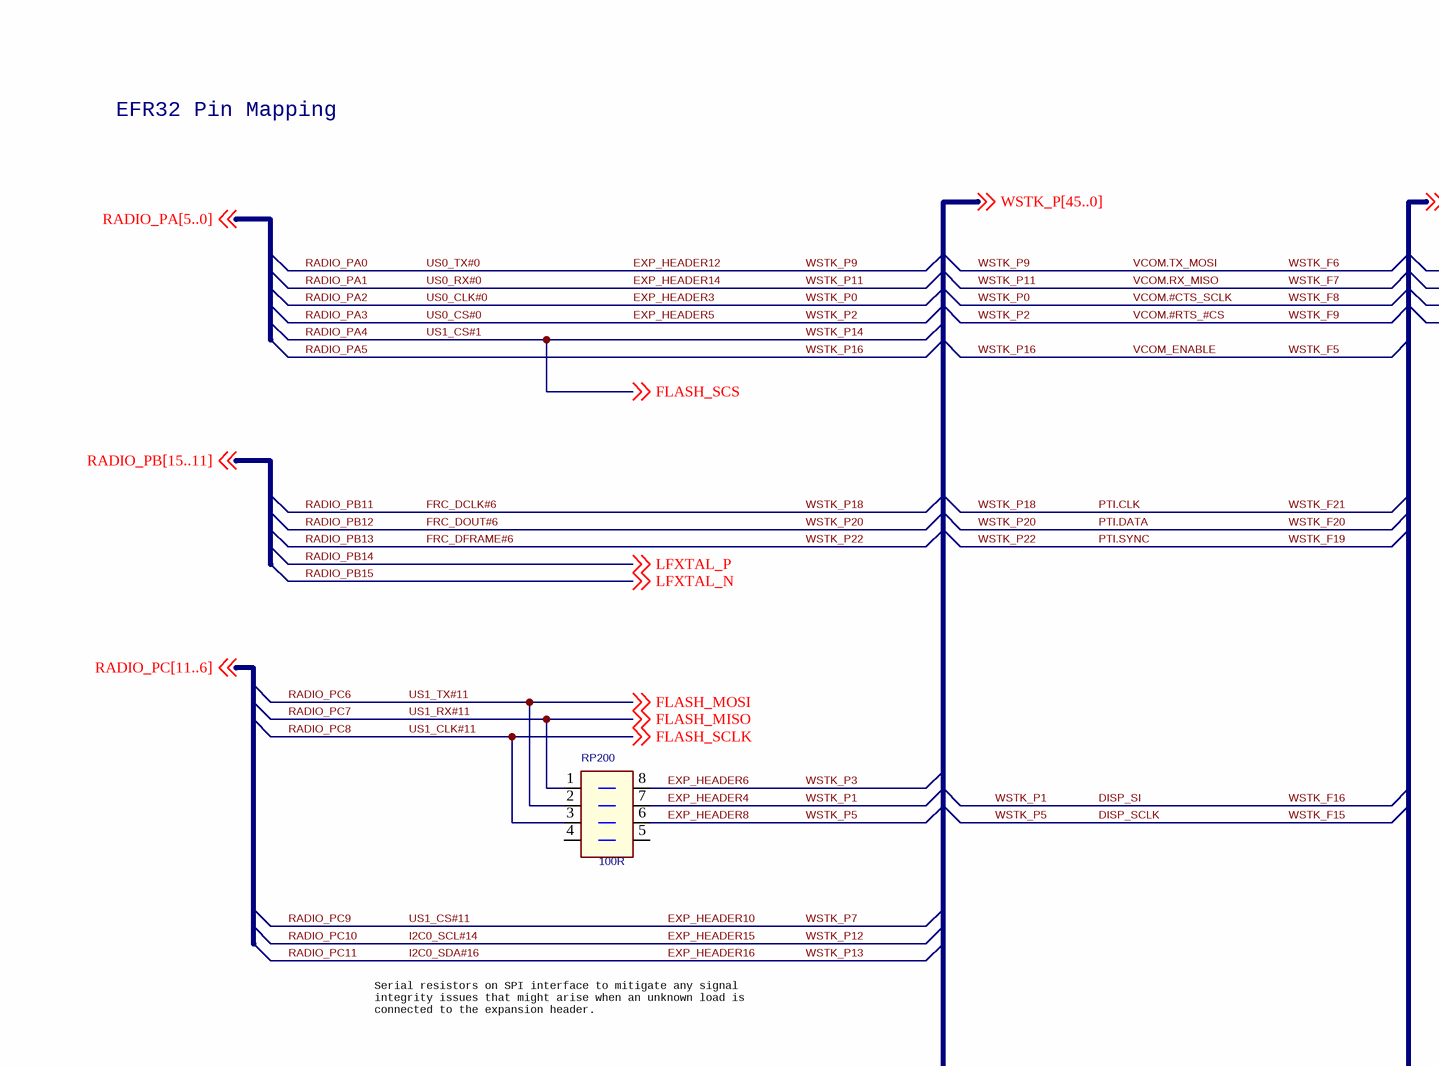
[diagram p4: EFR32xG1x_DISC_WIDEBAND_REF_DES_A00_03_ EFR32_Signal_Assignment.SchDoc, top left]
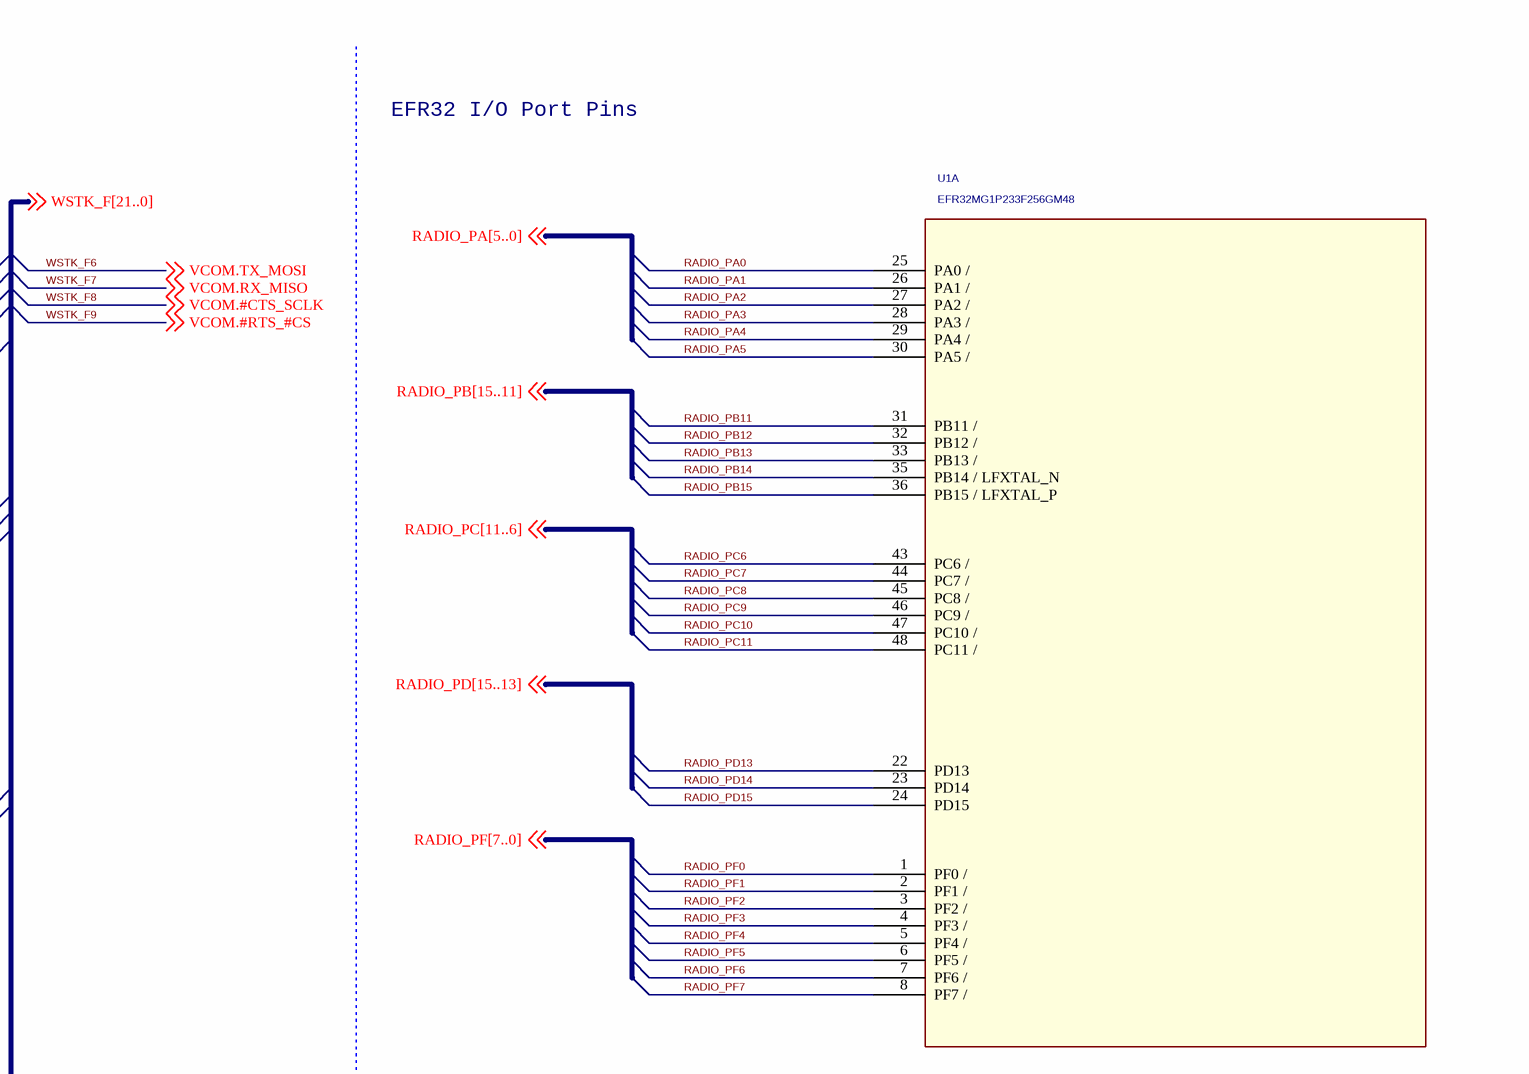
[diagram p5: EFR32xG1x_DISC_WIDEBAND_REF_DES_A00_03_ EFR32_Signal_Assignment.SchDoc, top right]
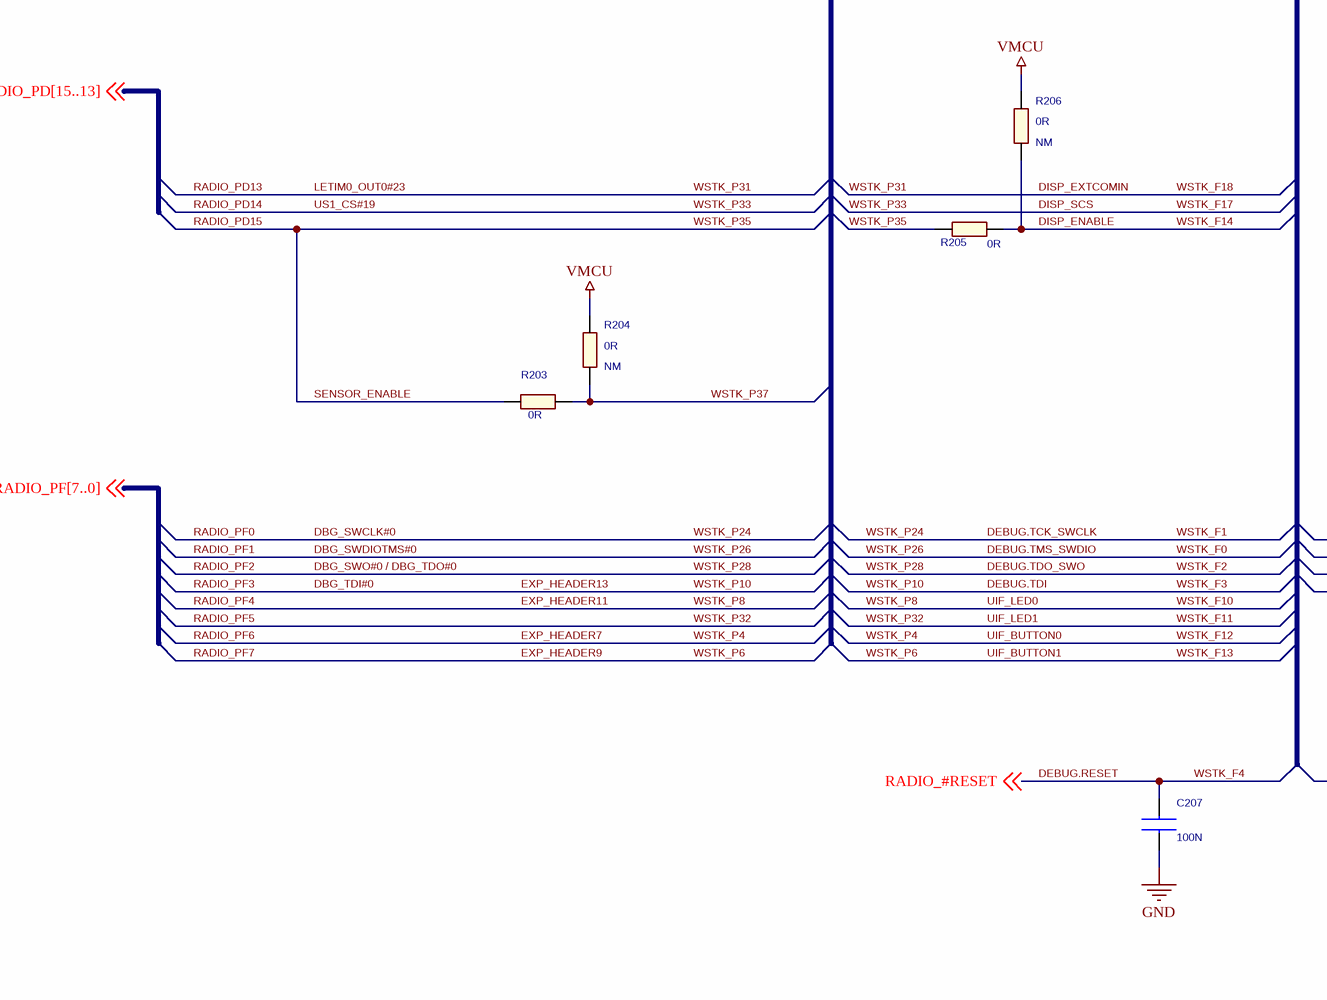
[diagram p6: EFR32xG1x_DISC_WIDEBAND_REF_DES_A00_03_ EFR32_Signal_Assignment.SchDoc, bottom left]
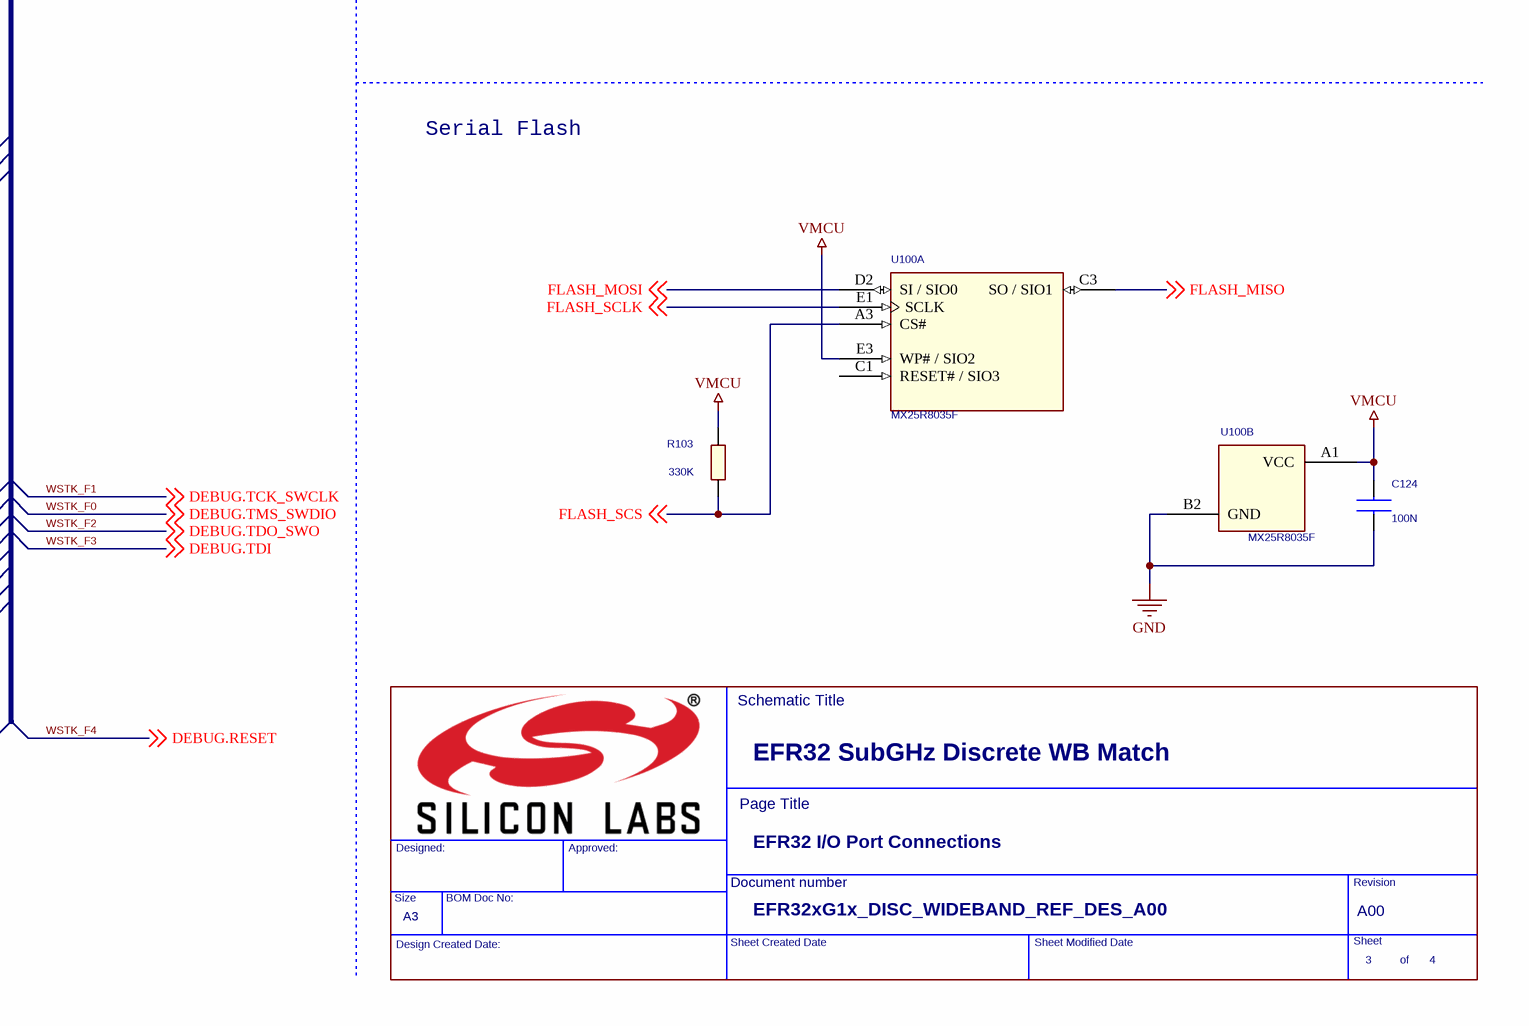
[diagram p7: EFR32xG1x_DISC_WIDEBAND_REF_DES_A00_03_ EFR32_Signal_Assignment.SchDoc, bottom right]

### Parts
(Parts that share a designator on the sheet are numbered #1, #2 ... from top to bottom, then left to right.)
*#7  Page Title: EFR32 I/O Port Connections  Page Size: A3  RevCode: A00  Title: EFR32 SubGHz Discrete WB Match  Doc: EFR32xG1x_DISC_WIDEBAND_REF_DES_A00  Page Number: 3  Page Count: 4  (hidden comment: TitleBlock_EnergyMicro_A3)  (graphical)
C124  100N  [C0402_L]
C207  100N  [C0402_L]
R103  330K  [R0402_L]
R203  0R  [R0402_L]
R204  0R  Not Mounted: NM  [R0402_L]
R205  0R  [R0402_L]
R206  0R  Not Mounted: NM  [R0402_L]
RP200  100R  [RES_MNR04-8]
U1#1  EFR32MG1P233F256GM48  [QFN48_M050_SQ7.0_EP_SL_L]  (part A of 3)
U100  MX25R8035F  [BGA8_M040_1.24x1.75_WLCSP]  (parts A,B of 2)

### Nets
GND: C124.2 C207.2 U100.B2(GND)
VMCU: C124.1 R103.1 R204.1 R206.1 U100.A1(VCC) U100.E3(WP#_/_SIO2)
DBG_SWCLK#0: U1#1.1(PF0_/) ; off-sheet DEBUG.TCK_SWCLK  [also labelled DEBUG.TCK_SWCLK, RADIO_PF0, WSTK_F1, WSTK_P24]
DBG_SWDIOTMS#0: U1#1.2(PF1_/) ; off-sheet DEBUG.TMS_SWDIO  [also labelled DEBUG.TMS_SWDIO, RADIO_PF1, WSTK_F0, WSTK_P26]
DBG_SWO#0 / DBG_TDO#0: U1#1.3(PF2_/) ; off-sheet DEBUG.TDO_SWO  [also labelled DEBUG.TDO_SWO, RADIO_PF2, WSTK_F2, WSTK_P28]
DBG_TDI#0: U1#1.4(PF3_/) ; off-sheet DEBUG.TDI  [also labelled DEBUG.TDI, EXP_HEADER13, RADIO_PF3, WSTK_F3, WSTK_P10]
DEBUG.RESET: C207.1 ; off-sheet RADIO_#RESET, off-sheet DEBUG.RESET  [also labelled RADIO_#RESET, WSTK_F4]
DISP_ENABLE: R205.2 R206.2  [also labelled WSTK_F14]
DISP_EXTCOMIN: U1#1.22(PD13)  [also labelled LETIM0_OUT0#23, RADIO_PD13, WSTK_F18, WSTK_P31]
DISP_SCLK: RP200.6(R16)  [also labelled EXP_HEADER8, WSTK_F15, WSTK_P5]
DISP_SCS: U1#1.23(PD14)  [also labelled RADIO_PD14, US1_CS#19, WSTK_F17, WSTK_P33]
DISP_SI: RP200.7(R17)  [also labelled EXP_HEADER4, WSTK_F16, WSTK_P1]
EXP_HEADER3: U1#1.27(PA2_/) ; off-sheet VCOM.#CTS_SCLK  [also labelled RADIO_PA2, US0_CLK#0, VCOM.#CTS_SCLK, WSTK_F8, WSTK_P0]
EXP_HEADER5: U1#1.28(PA3_/) ; off-sheet VCOM.#RTS_#CS  [also labelled RADIO_PA3, US0_CS#0, VCOM.#RTS_#CS, WSTK_F9, WSTK_P2]
EXP_HEADER6: RP200.8(R18)  [also labelled WSTK_P3]
EXP_HEADER7: U1#1.7(PF6_/)  [also labelled RADIO_PF6, UIF_BUTTON0, WSTK_F12, WSTK_P4]
EXP_HEADER9: U1#1.8(PF7_/)  [also labelled RADIO_PF7, UIF_BUTTON1, WSTK_F13, WSTK_P6]
EXP_HEADER10: U1#1.46(PC9_/)  [also labelled RADIO_PC9, US1_CS#11, WSTK_P7]
EXP_HEADER11: U1#1.5(PF4_/)  [also labelled RADIO_PF4, UIF_LED0, WSTK_F10, WSTK_P8]
EXP_HEADER12: U1#1.25(PA0_/) ; off-sheet VCOM.TX_MOSI  [also labelled RADIO_PA0, US0_TX#0, VCOM.TX_MOSI, WSTK_F6, WSTK_P9]
EXP_HEADER14: U1#1.26(PA1_/) ; off-sheet VCOM.RX_MISO  [also labelled RADIO_PA1, US0_RX#0, VCOM.RX_MISO, WSTK_F7, WSTK_P11]
EXP_HEADER15: U1#1.47(PC10_/)  [also labelled I2C0_SCL#14, RADIO_PC10, WSTK_P12]
EXP_HEADER16: U1#1.48(PC11_/)  [also labelled I2C0_SDA#16, RADIO_PC11, WSTK_P13]
FRC_DCLK#6: U1#1.31(PB11_/)  [also labelled PTI.CLK, RADIO_PB11, WSTK_F21, WSTK_P18]
FRC_DFRAME#6: U1#1.33(PB13_/)  [also labelled PTI.SYNC, RADIO_PB13, WSTK_F19, WSTK_P22]
FRC_DOUT#6: U1#1.32(PB12_/)  [also labelled PTI.DATA, RADIO_PB12, WSTK_F20, WSTK_P20]
RADIO_PA4: R103.2 U1#1.29(PA4_/) U100.A3(CS#) ; off-sheet FLASH_SCS  [also labelled FLASH_SCS, US1_CS#1, WSTK_P14]
RADIO_PA5: U1#1.30(PA5_/)  [also labelled VCOM_ENABLE, WSTK_F5, WSTK_P16]
RADIO_PB14: U1#1.35(PB14_/_LFXTAL_N) ; off-sheet LFXTAL_P  [also labelled LFXTAL_P]
RADIO_PB15: U1#1.36(PB15_/_LFXTAL_P) ; off-sheet LFXTAL_N  [also labelled LFXTAL_N]
RADIO_PC6: RP200.2(R12) U1#1.43(PC6_/) U100.D2(SI_/_SIO0) ; off-sheet FLASH_MOSI  [also labelled FLASH_MOSI, US1_TX#11]
RADIO_PC7: RP200.1(R11) U1#1.44(PC7_/) U100.C3(SO_/_SIO1) ; off-sheet FLASH_MISO  [also labelled FLASH_MISO, US1_RX#11]
RADIO_PC8: RP200.3(R13) U1#1.45(PC8_/) U100.E1(SCLK) ; off-sheet FLASH_SCLK  [also labelled FLASH_SCLK, US1_CLK#11]
RADIO_PD15: R203.1 R205.1 U1#1.24(PD15)  [also labelled SENSOR_ENABLE, WSTK_P35]
RADIO_PF5: U1#1.6(PF5_/)  [also labelled UIF_LED1, WSTK_F11, WSTK_P32]
WSTK_P37: R203.2 R204.2

Not connected (* = marked no-connect by the designer): RP200 4(R14) 5(R15); U100 C1(RESET#_/_SIO3)

### Notes on the sheet
- EFR32 Pin Mapping
- EFR32 I/O Port Pins
- Serial resistors on SPI interface to mitigate any signal
  integrity issues that might arise when an unknown load is
  connected to the expansion header.
- Serial Flash
- (in symbol TitleBlock_EnergyMicro_A3) Schematic Title; Page Title; Designed:; Approved:; Document number; Revision; Size; BOM Doc No:; Sheet; Design Created Date:; Sheet Created Date; Sheet Modified Date; of

### Library data of the parts
C124 C207 = C0402: Tolerance: 10%; Rating: 16V; Technology: X7R
R103 R203-R206 = R0402: Price_1K: 0.005
RP200 = MNR04M0APJ101: Mfg: ROHM; Price_1K: 0.0122; Mfg #: MNR04M0APJ101
U1#1 = EFR32-DUALBAND-QFN48: MFG #: EFR32MG1P233F256GM48-B0; MFG: Silicon Labs
U100 = MX25R8035: Mfg #: MX25R8035FBDIL0; Mfg: Macronix

## Sheet EFR32xG1x_DISC_WIDEBAND_REF_DES_A00_04_ WSTK_Connectors&B.SchDoc
size 420 x 297 mm
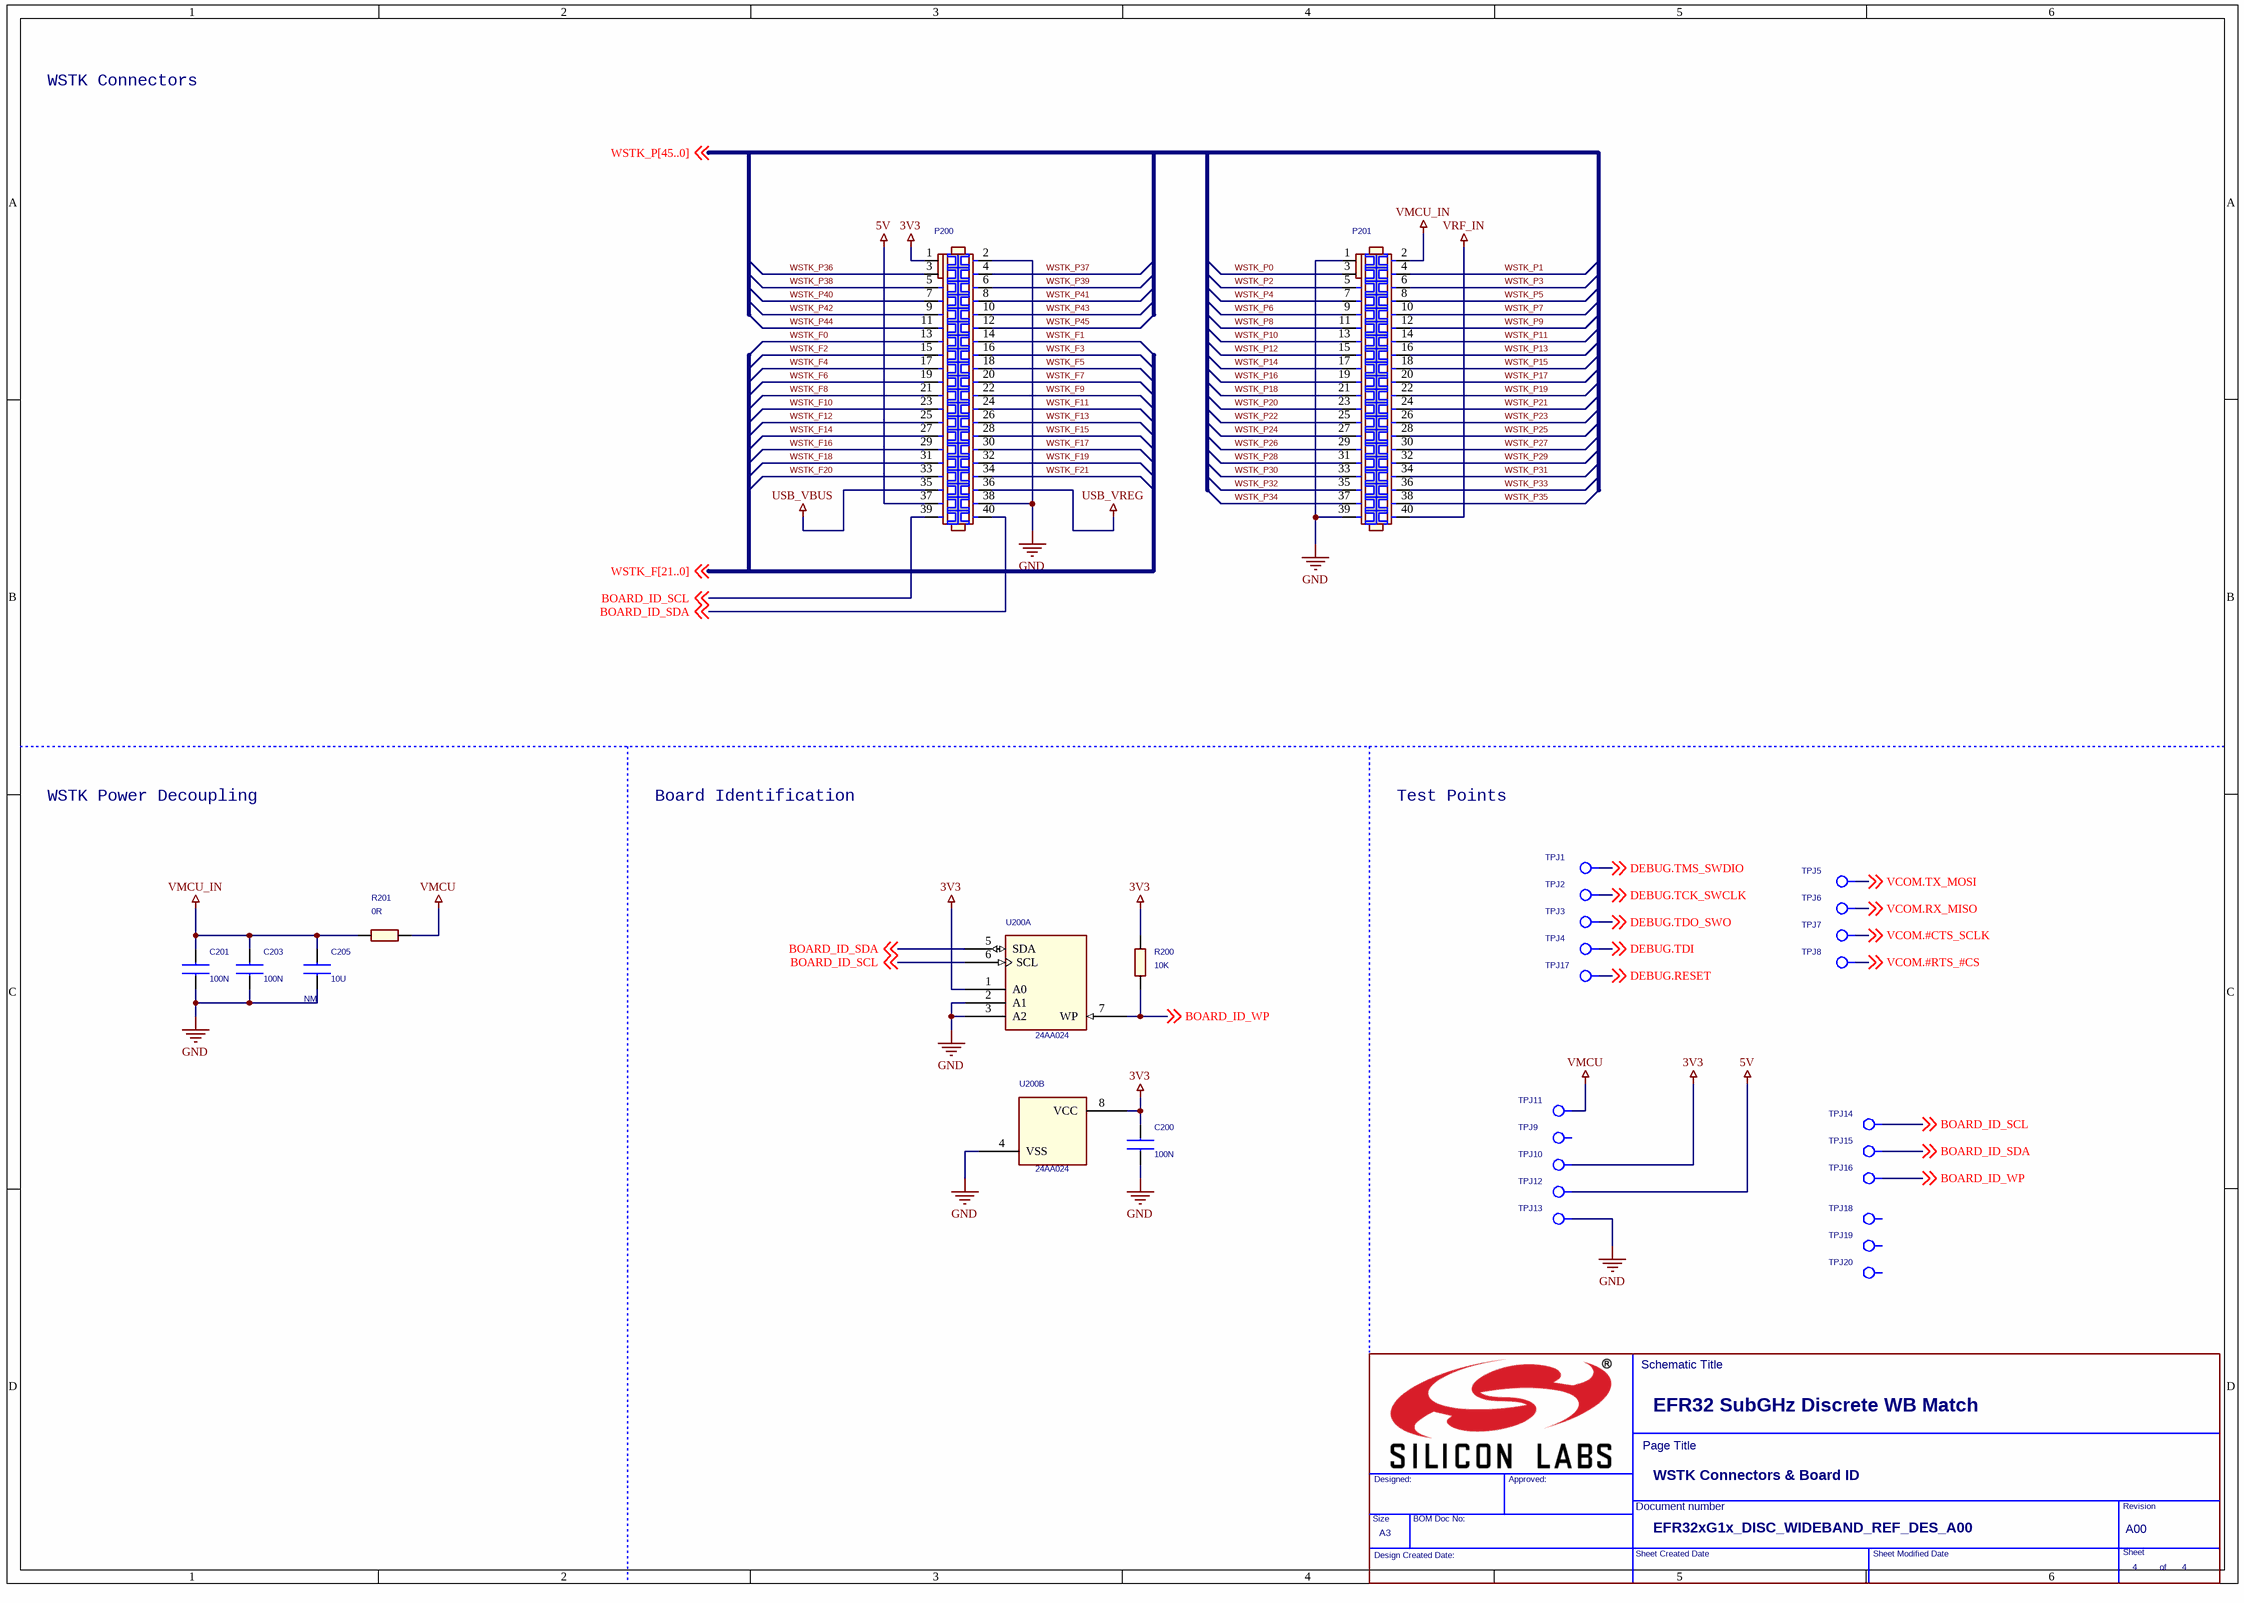
[diagram p8: EFR32xG1x_DISC_WIDEBAND_REF_DES_A00_04_ WSTK_Connectors&B.SchDoc]

### Parts
(Parts that share a designator on the sheet are numbered #1, #2 ... from top to bottom, then left to right.)
*#8  Page Title: WSTK Connectors & Board ID  Page Size: A3  RevCode: A00  Title: EFR32 SubGHz Discrete WB Match  Doc: EFR32xG1x_DISC_WIDEBAND_REF_DES_A00  Page Number: 4  (hidden comment: TitleBlock_EnergyMicro_A3)  (graphical)
C200  100N  [C0402_L]
C201  100N  [C0402_L]
C203  100N  [C0402_L]
C205  10U  Not Mounted: NM  [C0805_L]
P200  SOCKET_2X20_1.27MM_SMD  [SAM_SFC-120-T2-D-A-2X20_SNUM]  (value not drawn)
P201  SOCKET_2X20_1.27MM_SMD  [SAM_SFC-120-T2-D-A-2X20_SNUM]  (value not drawn)
R200  10K  [R0402_L]
R201  0R  [R0402_L]
TPJ1  TPJ_SMD  [TP_1.0_SMD]  (value not drawn)
TPJ2  TPJ_SMD  [TP_1.0_SMD]  (value not drawn)
TPJ3  TPJ_SMD  [TP_1.0_SMD]  (value not drawn)
TPJ4  TPJ_SMD  [TP_1.0_SMD]  (value not drawn)
TPJ5  TPJ_SMD  [TP_1.0_SMD]  (value not drawn)
TPJ6  TPJ_SMD  [TP_1.0_SMD]  (value not drawn)
TPJ7  TPJ_SMD  [TP_1.0_SMD]  (value not drawn)
TPJ8  TPJ_SMD  [TP_1.0_SMD]  (value not drawn)
TPJ9  TPJ_SMD  [TP_1.0_SMD]  (value not drawn)
TPJ10  TPJ_SMD  [TP_1.0_SMD]  (value not drawn)
TPJ11  TPJ_SMD  [TP_1.0_SMD]  (value not drawn)
TPJ12  TPJ_SMD  [TP_1.0_SMD]  (value not drawn)
TPJ13  TPJ_SMD  [TP_1.0_SMD]  (value not drawn)
TPJ14  TPJ_SMD  [TP_1.0_SMD]  (value not drawn)
TPJ15  TPJ_SMD  [TP_1.0_SMD]  (value not drawn)
TPJ16  TPJ_SMD  [TP_1.0_SMD]  (value not drawn)
TPJ17  TPJ_SMD  [TP_1.0_SMD]  (value not drawn)
TPJ18  TPJ_SMD  [TP_1.0_SMD]  (value not drawn)
TPJ19  TPJ_SMD  [TP_1.0_SMD]  (value not drawn)
TPJ20  TPJ_SMD  [TP_1.0_SMD]  (value not drawn)
U200  24AA024  [TDFN8_M050_2.0X3.0_EP]  (parts A,B of 2)

### Nets
3V3: C200.1 P200.1 R200.2 TPJ10.1(TP) U200.1(A0) U200.8(VCC)
5V: P200.37 TPJ12.1(TP)
GND: C200.2 C201.2 C203.2 C205.2 P200.2 P200.38 P201.1 P201.39 TPJ13.1(TP) U200.2(A1) U200.3(A2) U200.4(VSS)
USB_VBUS: P200.35
USB_VREG: P200.36
VMCU: R201.2 TPJ11.1(TP)
VMCU_IN: C201.1 C203.1 C205.1 P201.2 R201.1
VRF_IN: P201.40
BOARD_ID_SCL: P200.39 TPJ14.1(TP) U200.6(SCL) ; off-sheet BOARD_ID_SCL
BOARD_ID_SDA: P200.40 TPJ15.1(TP) U200.5(SDA) ; off-sheet BOARD_ID_SDA
BOARD_ID_WP: R200.1 TPJ16.1(TP) U200.7(WP) ; off-sheet BOARD_ID_WP
DEBUG.RESET: P200.17 TPJ17.1(TP) ; off-sheet DEBUG.RESET  [also labelled WSTK_F4]
DEBUG.TCK_SWCLK: P200.14 P201.27 TPJ2.1(TP) ; off-sheet DEBUG.TCK_SWCLK  [also labelled WSTK_F1, WSTK_P24]  [project net DBG_SWCLK#0]
DEBUG.TDI: P200.16 P201.13 TPJ4.1(TP) ; off-sheet DEBUG.TDI  [also labelled WSTK_F3, WSTK_P10]  [project net DBG_TDI#0]
DEBUG.TDO_SWO: P200.15 P201.31 TPJ3.1(TP) ; off-sheet DEBUG.TDO_SWO  [also labelled WSTK_F2, WSTK_P28]  [project net DBG_SWO#0 / DBG_TDO#0]
DEBUG.TMS_SWDIO: P200.13 P201.29 TPJ1.1(TP) ; off-sheet DEBUG.TMS_SWDIO  [also labelled WSTK_F0, WSTK_P26]  [project net DBG_SWDIOTMS#0]
VCOM.#CTS_SCLK: P200.21 P201.3 TPJ7.1(TP) ; off-sheet VCOM.#CTS_SCLK  [also labelled WSTK_F8, WSTK_P0]  [project net EXP_HEADER3]
VCOM.#RTS_#CS: P200.22 P201.5 TPJ8.1(TP) ; off-sheet VCOM.#RTS_#CS  [also labelled WSTK_F9, WSTK_P2]  [project net EXP_HEADER5]
VCOM.RX_MISO: P200.20 P201.14 TPJ6.1(TP) ; off-sheet VCOM.RX_MISO  [also labelled WSTK_F7, WSTK_P11]  [project net EXP_HEADER14]
VCOM.TX_MOSI: P200.19 P201.12 TPJ5.1(TP) ; off-sheet VCOM.TX_MOSI  [also labelled WSTK_F6, WSTK_P9]  [project net EXP_HEADER12]
WSTK_F5: P200.18 P201.19  [also labelled WSTK_P16]  [project net RADIO_PA5]
WSTK_F10: P200.23 P201.11  [also labelled WSTK_P8]  [project net EXP_HEADER11]
WSTK_F11: P200.24 P201.35  [also labelled WSTK_P32]  [project net RADIO_PF5]
WSTK_F12: P200.25 P201.7  [also labelled WSTK_P4]  [project net EXP_HEADER7]
WSTK_F13: P200.26 P201.9  [also labelled WSTK_P6]  [project net EXP_HEADER9]
WSTK_F14: P200.27  [project net DISP_ENABLE]
WSTK_F15: P200.28 P201.8  [also labelled WSTK_P5]  [project net DISP_SCLK]
WSTK_F16: P200.29 P201.4  [also labelled WSTK_P1]  [project net DISP_SI]
WSTK_F17: P200.30 P201.36  [also labelled WSTK_P33]  [project net DISP_SCS]
WSTK_F18: P200.31 P201.34  [also labelled WSTK_P31]  [project net DISP_EXTCOMIN]
WSTK_F19: P200.32 P201.25  [also labelled WSTK_P22]  [project net FRC_DFRAME#6]
WSTK_F20: P200.33 P201.23  [also labelled WSTK_P20]  [project net FRC_DOUT#6]
WSTK_F21: P200.34 P201.21  [also labelled WSTK_P18]  [project net FRC_DCLK#6]
WSTK_P3: P201.6  [project net EXP_HEADER6]
WSTK_P7: P201.10  [project net EXP_HEADER10]
WSTK_P12: P201.15  [project net EXP_HEADER15]
WSTK_P13: P201.16  [project net EXP_HEADER16]
WSTK_P14: P201.17  [project net RADIO_PA4]
WSTK_P15: P201.18
WSTK_P17: P201.20
WSTK_P19: P201.22
WSTK_P21: P201.24
WSTK_P23: P201.26
WSTK_P25: P201.28
WSTK_P27: P201.30
WSTK_P29: P201.32
WSTK_P30: P201.33
WSTK_P34: P201.37
WSTK_P35: P201.38  [project net RADIO_PD15]
WSTK_P36: P200.3
WSTK_P37: P200.4
WSTK_P38: P200.5
WSTK_P39: P200.6
WSTK_P40: P200.7
WSTK_P41: P200.8
WSTK_P42: P200.9
WSTK_P43: P200.10
WSTK_P44: P200.11
WSTK_P45: P200.12

Not connected (* = marked no-connect by the designer): TPJ9 1(TP); TPJ18 1(TP); TPJ19 1(TP); TPJ20 1(TP)

### Notes on the sheet
- WSTK Connectors
- WSTK Power Decoupling
- Board Identification
- Test Points
- (in symbol TitleBlock_EnergyMicro_A3) Schematic Title; Page Title; Designed:; Approved:; Document number; Revision; Size; BOM Doc No:; Sheet; Design Created Date:; Sheet Created Date; Sheet Modified Date; of

### Library data of the parts
C200 C201 C203 = C0402: Tolerance: 10%; Rating: 16V; Technology: X7R
C205 = C0805: Tolerance: 10%; Rating: 10V; Technology: X5R
P200 P201 = SOCKET_2X20_1.27MM_SMD: Mfg #: SFC-120-T2-L-D-A-K-TR; Mfg: Samtec; Price_1K: 3.44
R200 R201 = R0402: Price_1K: 0.005
U200 = 24AA024: Mfg: Microchip; Mfg #: 24AA024T-I/MNY; Price_1K: 0.22
*#8 = TitleBlock_EnergyMicro_A3: Page Count: 4

## Nets that join several sheets
GND: EFR32xG1x_DISC_WIDEBAND_REF_DES_A00_02_ RF,Antenna&Power_HB_HQ (36 pins), EFR32xG1x_DISC_WIDEBAND_REF_DES_A00_02_ RF,Antenna&Power_HB_TN (36 pins), EFR32xG1x_DISC_WIDEBAND_REF_DES_A00_02_ RF,Antenna&Power_LB (36 pins), EFR32xG1x_DISC_WIDEBAND_REF_DES_A00_03_ EFR32_Signal_Assignment (C124.2 C207.2 U100.B2), EFR32xG1x_DISC_WIDEBAND_REF_DES_A00_04_ WSTK_Connectors&B (12 pins)
PAVDD: EFR32xG1x_DISC_WIDEBAND_REF_DES_A00_02_ RF,Antenna&Power_HB_HQ (L103#1.1 R210#1.1 R211#1.1), EFR32xG1x_DISC_WIDEBAND_REF_DES_A00_02_ RF,Antenna&Power_HB_TN (L103#2.1 R210#2.1 R211#2.1), EFR32xG1x_DISC_WIDEBAND_REF_DES_A00_02_ RF,Antenna&Power_LB (L103#3.1 R210#3.1 R211#3.1)
VBIAS: EFR32xG1x_DISC_WIDEBAND_REF_DES_A00_02_ RF,Antenna&Power_HB_HQ (5 pins), EFR32xG1x_DISC_WIDEBAND_REF_DES_A00_02_ RF,Antenna&Power_HB_TN (5 pins), EFR32xG1x_DISC_WIDEBAND_REF_DES_A00_02_ RF,Antenna&Power_LB (5 pins)
VDCDC: EFR32xG1x_DISC_WIDEBAND_REF_DES_A00_02_ RF,Antenna&Power_HB_HQ (6 pins), EFR32xG1x_DISC_WIDEBAND_REF_DES_A00_02_ RF,Antenna&Power_HB_TN (6 pins), EFR32xG1x_DISC_WIDEBAND_REF_DES_A00_02_ RF,Antenna&Power_LB (6 pins)
VMCU: EFR32xG1x_DISC_WIDEBAND_REF_DES_A00_02_ RF,Antenna&Power_HB_HQ (7 pins), EFR32xG1x_DISC_WIDEBAND_REF_DES_A00_02_ RF,Antenna&Power_HB_TN (7 pins), EFR32xG1x_DISC_WIDEBAND_REF_DES_A00_02_ RF,Antenna&Power_LB (7 pins), EFR32xG1x_DISC_WIDEBAND_REF_DES_A00_03_ EFR32_Signal_Assignment (6 pins), EFR32xG1x_DISC_WIDEBAND_REF_DES_A00_04_ WSTK_Connectors&B (R201.2 TPJ11.1)
DBG_SWCLK#0: EFR32xG1x_DISC_WIDEBAND_REF_DES_A00_03_ EFR32_Signal_Assignment (U1#1.1), EFR32xG1x_DISC_WIDEBAND_REF_DES_A00_04_ WSTK_Connectors&B (P200.14 P201.27 TPJ2.1)
DBG_SWDIOTMS#0: EFR32xG1x_DISC_WIDEBAND_REF_DES_A00_03_ EFR32_Signal_Assignment (U1#1.2), EFR32xG1x_DISC_WIDEBAND_REF_DES_A00_04_ WSTK_Connectors&B (P200.13 P201.29 TPJ1.1)
DBG_SWO#0 / DBG_TDO#0: EFR32xG1x_DISC_WIDEBAND_REF_DES_A00_03_ EFR32_Signal_Assignment (U1#1.3), EFR32xG1x_DISC_WIDEBAND_REF_DES_A00_04_ WSTK_Connectors&B (P200.15 P201.31 TPJ3.1)
DBG_TDI#0: EFR32xG1x_DISC_WIDEBAND_REF_DES_A00_03_ EFR32_Signal_Assignment (U1#1.4), EFR32xG1x_DISC_WIDEBAND_REF_DES_A00_04_ WSTK_Connectors&B (P200.16 P201.13 TPJ4.1)
DEBUG.RESET: EFR32xG1x_DISC_WIDEBAND_REF_DES_A00_02_ RF,Antenna&Power_HB_HQ (U1#1.12), EFR32xG1x_DISC_WIDEBAND_REF_DES_A00_02_ RF,Antenna&Power_HB_TN (U1#2.12), EFR32xG1x_DISC_WIDEBAND_REF_DES_A00_02_ RF,Antenna&Power_LB (U1#3.12), EFR32xG1x_DISC_WIDEBAND_REF_DES_A00_03_ EFR32_Signal_Assignment (C207.1), EFR32xG1x_DISC_WIDEBAND_REF_DES_A00_04_ WSTK_Connectors&B (P200.17 TPJ17.1)
DISP_ENABLE: EFR32xG1x_DISC_WIDEBAND_REF_DES_A00_03_ EFR32_Signal_Assignment (R205.2 R206.2), EFR32xG1x_DISC_WIDEBAND_REF_DES_A00_04_ WSTK_Connectors&B (P200.27)
DISP_EXTCOMIN: EFR32xG1x_DISC_WIDEBAND_REF_DES_A00_03_ EFR32_Signal_Assignment (U1#1.22), EFR32xG1x_DISC_WIDEBAND_REF_DES_A00_04_ WSTK_Connectors&B (P200.31 P201.34)
DISP_SCLK: EFR32xG1x_DISC_WIDEBAND_REF_DES_A00_03_ EFR32_Signal_Assignment (RP200.6), EFR32xG1x_DISC_WIDEBAND_REF_DES_A00_04_ WSTK_Connectors&B (P200.28 P201.8)
DISP_SCS: EFR32xG1x_DISC_WIDEBAND_REF_DES_A00_03_ EFR32_Signal_Assignment (U1#1.23), EFR32xG1x_DISC_WIDEBAND_REF_DES_A00_04_ WSTK_Connectors&B (P200.30 P201.36)
DISP_SI: EFR32xG1x_DISC_WIDEBAND_REF_DES_A00_03_ EFR32_Signal_Assignment (RP200.7), EFR32xG1x_DISC_WIDEBAND_REF_DES_A00_04_ WSTK_Connectors&B (P200.29 P201.4)
EXP_HEADER3: EFR32xG1x_DISC_WIDEBAND_REF_DES_A00_03_ EFR32_Signal_Assignment (U1#1.27), EFR32xG1x_DISC_WIDEBAND_REF_DES_A00_04_ WSTK_Connectors&B (P200.21 P201.3 TPJ7.1)
EXP_HEADER5: EFR32xG1x_DISC_WIDEBAND_REF_DES_A00_03_ EFR32_Signal_Assignment (U1#1.28), EFR32xG1x_DISC_WIDEBAND_REF_DES_A00_04_ WSTK_Connectors&B (P200.22 P201.5 TPJ8.1)
EXP_HEADER6: EFR32xG1x_DISC_WIDEBAND_REF_DES_A00_03_ EFR32_Signal_Assignment (RP200.8), EFR32xG1x_DISC_WIDEBAND_REF_DES_A00_04_ WSTK_Connectors&B (P201.6)
EXP_HEADER7: EFR32xG1x_DISC_WIDEBAND_REF_DES_A00_03_ EFR32_Signal_Assignment (U1#1.7), EFR32xG1x_DISC_WIDEBAND_REF_DES_A00_04_ WSTK_Connectors&B (P200.25 P201.7)
EXP_HEADER9: EFR32xG1x_DISC_WIDEBAND_REF_DES_A00_03_ EFR32_Signal_Assignment (U1#1.8), EFR32xG1x_DISC_WIDEBAND_REF_DES_A00_04_ WSTK_Connectors&B (P200.26 P201.9)
EXP_HEADER10: EFR32xG1x_DISC_WIDEBAND_REF_DES_A00_03_ EFR32_Signal_Assignment (U1#1.46), EFR32xG1x_DISC_WIDEBAND_REF_DES_A00_04_ WSTK_Connectors&B (P201.10)
EXP_HEADER11: EFR32xG1x_DISC_WIDEBAND_REF_DES_A00_03_ EFR32_Signal_Assignment (U1#1.5), EFR32xG1x_DISC_WIDEBAND_REF_DES_A00_04_ WSTK_Connectors&B (P200.23 P201.11)
EXP_HEADER12: EFR32xG1x_DISC_WIDEBAND_REF_DES_A00_03_ EFR32_Signal_Assignment (U1#1.25), EFR32xG1x_DISC_WIDEBAND_REF_DES_A00_04_ WSTK_Connectors&B (P200.19 P201.12 TPJ5.1)
EXP_HEADER14: EFR32xG1x_DISC_WIDEBAND_REF_DES_A00_03_ EFR32_Signal_Assignment (U1#1.26), EFR32xG1x_DISC_WIDEBAND_REF_DES_A00_04_ WSTK_Connectors&B (P200.20 P201.14 TPJ6.1)
EXP_HEADER15: EFR32xG1x_DISC_WIDEBAND_REF_DES_A00_03_ EFR32_Signal_Assignment (U1#1.47), EFR32xG1x_DISC_WIDEBAND_REF_DES_A00_04_ WSTK_Connectors&B (P201.15)
EXP_HEADER16: EFR32xG1x_DISC_WIDEBAND_REF_DES_A00_03_ EFR32_Signal_Assignment (U1#1.48), EFR32xG1x_DISC_WIDEBAND_REF_DES_A00_04_ WSTK_Connectors&B (P201.16)
FRC_DCLK#6: EFR32xG1x_DISC_WIDEBAND_REF_DES_A00_03_ EFR32_Signal_Assignment (U1#1.31), EFR32xG1x_DISC_WIDEBAND_REF_DES_A00_04_ WSTK_Connectors&B (P200.34 P201.21)
FRC_DFRAME#6: EFR32xG1x_DISC_WIDEBAND_REF_DES_A00_03_ EFR32_Signal_Assignment (U1#1.33), EFR32xG1x_DISC_WIDEBAND_REF_DES_A00_04_ WSTK_Connectors&B (P200.32 P201.25)
FRC_DOUT#6: EFR32xG1x_DISC_WIDEBAND_REF_DES_A00_03_ EFR32_Signal_Assignment (U1#1.32), EFR32xG1x_DISC_WIDEBAND_REF_DES_A00_04_ WSTK_Connectors&B (P200.33 P201.23)
RADIO_PA4: EFR32xG1x_DISC_WIDEBAND_REF_DES_A00_03_ EFR32_Signal_Assignment (R103.2 U1#1.29 U100.A3), EFR32xG1x_DISC_WIDEBAND_REF_DES_A00_04_ WSTK_Connectors&B (P201.17)
RADIO_PA5: EFR32xG1x_DISC_WIDEBAND_REF_DES_A00_03_ EFR32_Signal_Assignment (U1#1.30), EFR32xG1x_DISC_WIDEBAND_REF_DES_A00_04_ WSTK_Connectors&B (P200.18 P201.19)
RADIO_PB14: EFR32xG1x_DISC_WIDEBAND_REF_DES_A00_02_ RF,Antenna&Power_HB_HQ (X2#1.2), EFR32xG1x_DISC_WIDEBAND_REF_DES_A00_02_ RF,Antenna&Power_HB_TN (X2#2.2), EFR32xG1x_DISC_WIDEBAND_REF_DES_A00_02_ RF,Antenna&Power_LB (X2#3.2), EFR32xG1x_DISC_WIDEBAND_REF_DES_A00_03_ EFR32_Signal_Assignment (U1#1.35)
RADIO_PB15: EFR32xG1x_DISC_WIDEBAND_REF_DES_A00_02_ RF,Antenna&Power_HB_HQ (X2#1.1), EFR32xG1x_DISC_WIDEBAND_REF_DES_A00_02_ RF,Antenna&Power_HB_TN (X2#2.1), EFR32xG1x_DISC_WIDEBAND_REF_DES_A00_02_ RF,Antenna&Power_LB (X2#3.1), EFR32xG1x_DISC_WIDEBAND_REF_DES_A00_03_ EFR32_Signal_Assignment (U1#1.36)
RADIO_PD15: EFR32xG1x_DISC_WIDEBAND_REF_DES_A00_03_ EFR32_Signal_Assignment (R203.1 R205.1 U1#1.24), EFR32xG1x_DISC_WIDEBAND_REF_DES_A00_04_ WSTK_Connectors&B (P201.38)
RADIO_PF5: EFR32xG1x_DISC_WIDEBAND_REF_DES_A00_03_ EFR32_Signal_Assignment (U1#1.6), EFR32xG1x_DISC_WIDEBAND_REF_DES_A00_04_ WSTK_Connectors&B (P200.24 P201.35)
Tline: EFR32xG1x_DISC_WIDEBAND_REF_DES_A00_02_ RF,Antenna&Power_HB_HQ (C7#1.2 P1#1.1 TP1#1.1), EFR32xG1x_DISC_WIDEBAND_REF_DES_A00_02_ RF,Antenna&Power_HB_TN (C7#2.2 P1#2.1 TP1#2.1), EFR32xG1x_DISC_WIDEBAND_REF_DES_A00_02_ RF,Antenna&Power_LB (C7#3.2 P1#3.1 TP1#3.1)
WSTK_P37: EFR32xG1x_DISC_WIDEBAND_REF_DES_A00_03_ EFR32_Signal_Assignment (R203.2 R204.2), EFR32xG1x_DISC_WIDEBAND_REF_DES_A00_04_ WSTK_Connectors&B (P200.4)

## Assembly variants
DEV4176A: all parts fitted